# Altium project PIN_CubeSat.PrjPCB (part 1 of 2)
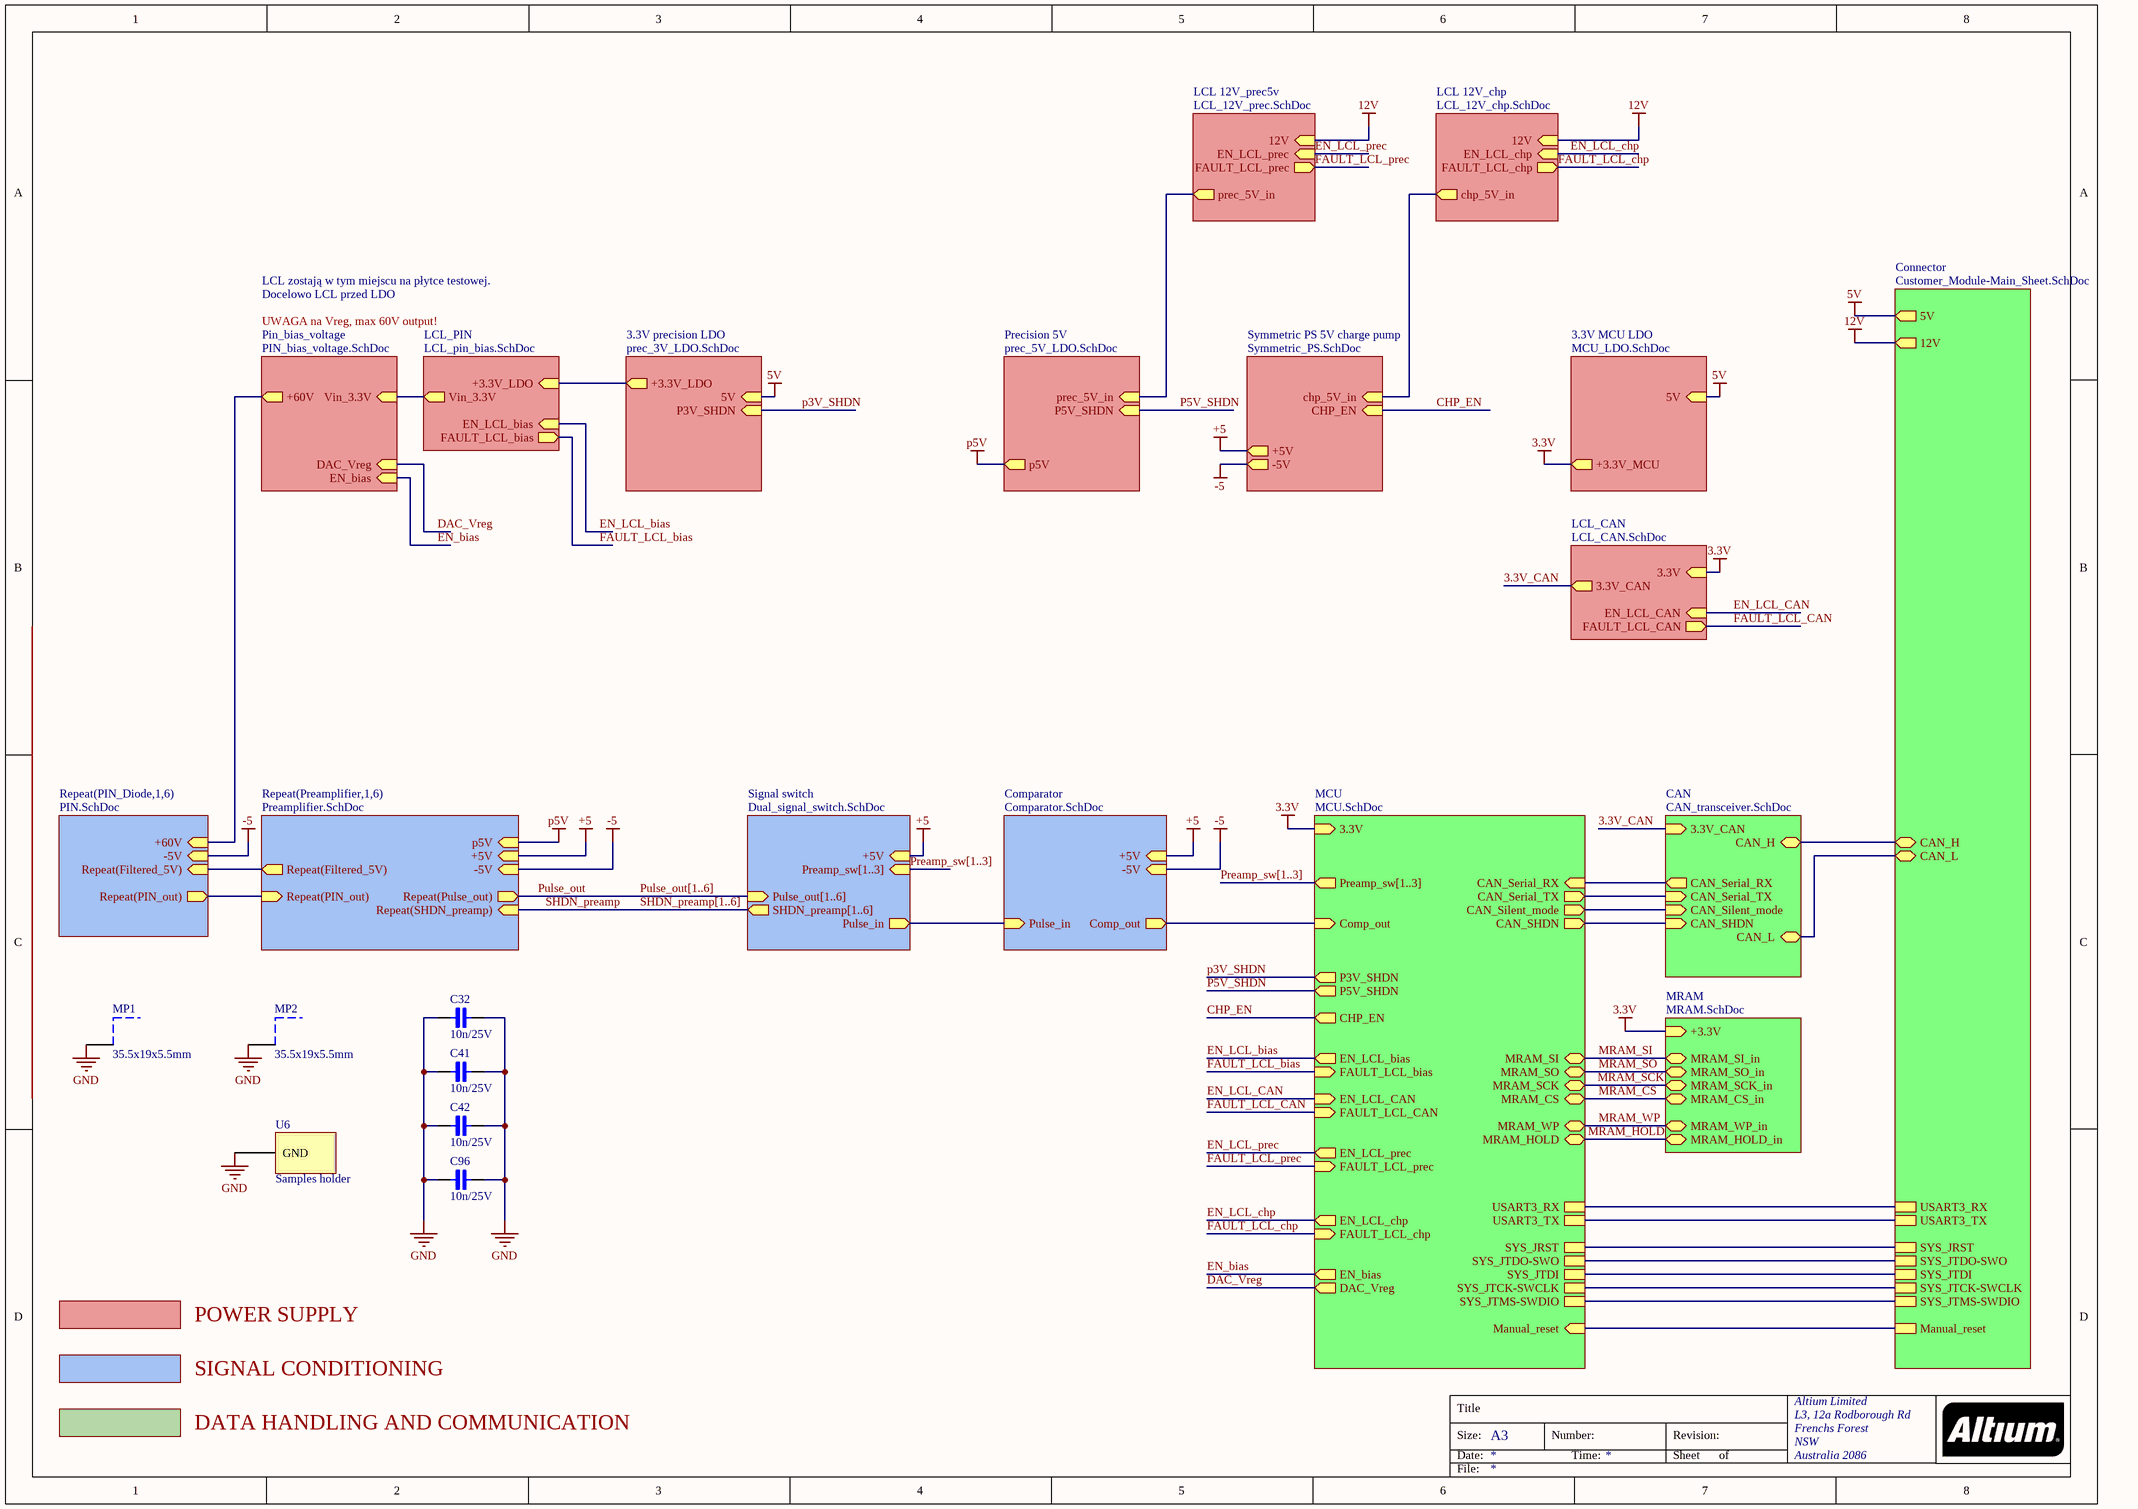
[diagram p0: General_design.SchDoc]
25 sheets, 512 parts. Net scope: hierarchical (ports join the sheet entries above them; power ports are global).
Board file: PIN_detector_test_module.PcbDoc
Sheets:
  General_design.SchDoc
    PIN_Diode1 = PIN.SchDoc
    PIN_Diode2 = PIN.SchDoc
    PIN_Diode3 = PIN.SchDoc
    PIN_Diode4 = PIN.SchDoc
    PIN_Diode5 = PIN.SchDoc
    PIN_Diode6 = PIN.SchDoc
    Preamplifier1 = Preamplifier.SchDoc
    Preamplifier2 = Preamplifier.SchDoc
    Preamplifier3 = Preamplifier.SchDoc
    Preamplifier4 = Preamplifier.SchDoc
    Preamplifier5 = Preamplifier.SchDoc
    Preamplifier6 = Preamplifier.SchDoc
    Pin_bias_voltage = PIN_bias_voltage.SchDoc
    MCU = MCU.SchDoc
    Connector = Customer_Module-Main_Sheet.SchDoc
      Main_Connector = Customer_Module-Main_Connector.SchDoc
      APS_Connector = Customer_Module-APS_Connector.SchDoc
    Comparator = Comparator.SchDoc
    Symmetric PS 5V charge pump = Symmetric_PS.SchDoc
    3.3V precision LDO = prec_3V_LDO.SchDoc
    CAN = CAN_transceiver.SchDoc
    MRAM = MRAM.SchDoc
    LCL_PIN = LCL_pin_bias.SchDoc
    Precision 5V = prec_5V_LDO.SchDoc
    LCL 12V_prec5v = LCL_12V_prec.SchDoc
    LCL 12V_chp = LCL_12V_chp.SchDoc
    Signal switch = Dual_signal_switch.SchDoc
    3.3V MCU LDO = MCU_LDO.SchDoc
    LCL_CAN = LCL_CAN.SchDoc
  LCL_SYM_5V.SchDoc
  Signal_switch.SchDoc
  Preamplifier_switch.SchDoc
  Temp_sensors.SchDoc
  MCU_48pin.SchDoc

## Sheet General_design.SchDoc
size A3; Organization: Altium Limited; Address1: L3, 12a Rodborough Rd; Address2: Frenchs Forest; Address3: NSW; Address4: Australia 2086

### Parts
C32  10n/25V  [Cap_0402]
C41  10n/25V  [Cap_0402]
C42  10n/25V  [Cap_0402]
C96  10n/25V  [Cap_0402]
MP1  35.5x19x5.5mm  [Shiled_35x19]
MP2  35.5x19x5.5mm  [Shiled_35x19]
U6  Samples holder  [RAD_Samples_Holder]

### Sub-sheets
3.3V MCU LDO = MCU_LDO.SchDoc: 5V (in), +3.3V_MCU (out)
3.3V precision LDO = prec_3V_LDO.SchDoc: +3.3V_LDO (out), 5V (in), P3V_SHDN (in)
CAN = CAN_transceiver.SchDoc: 3.3V_CAN (in), CAN_Serial_RX (out), CAN_Serial_TX (in), CAN_H (bidir), CAN_L (bidir), CAN_Silent_mode (in), CAN_SHDN (in)
Comparator = Comparator.SchDoc: Pulse_in (in), Comp_out (out), +5V (in), -5V (in)
Connector = Customer_Module-Main_Sheet.SchDoc: 12V (out), 5V (out), CAN_H (bidir), CAN_L (bidir), SYS_JRST, SYS_JTDO-SWO, SYS_JTDI, SYS_JTCK-SWCLK, SYS_JTMS-SWDIO, USART3_RX, USART3_TX, Manual_reset
LCL 12V_chp = LCL_12V_chp.SchDoc: 12V (in), chp_5V_in (out), EN_LCL_chp (in), FAULT_LCL_chp (out)
LCL 12V_prec5v = LCL_12V_prec.SchDoc: 12V (in), prec_5V_in (out), EN_LCL_prec (in), FAULT_LCL_prec (out)
LCL_CAN = LCL_CAN.SchDoc: EN_LCL_CAN (in), FAULT_LCL_CAN (out), 3.3V (in), 3.3V_CAN (out)
LCL_PIN = LCL_pin_bias.SchDoc: EN_LCL_bias (in), FAULT_LCL_bias (out), +3.3V_LDO (in), Vin_3.3V (out)
MCU = MCU.SchDoc: 3.3V (in), Preamp_sw[1..3] (out), Comp_out (in), P3V_SHDN (out), P5V_SHDN (out), CHP_EN (out), EN_LCL_bias (out), FAULT_LCL_bias (in), EN_LCL_prec (out), FAULT_LCL_prec (in), EN_LCL_chp (out), FAULT_LCL_chp (in), EN_bias (out), CAN_Serial_RX (in), CAN_Serial_TX (out), CAN_Silent_mode (out), MRAM_SO (bidir), MRAM_SCK (bidir), MRAM_WP (bidir), MRAM_HOLD (bidir), MRAM_CS (bidir), MRAM_SI (bidir), DAC_Vreg (out), CAN_SHDN (out), SYS_JRST, SYS_JTDO-SWO, SYS_JTDI, SYS_JTCK-SWCLK, SYS_JTMS-SWDIO, USART3_RX, USART3_TX, Manual_reset (in), EN_LCL_CAN (in), FAULT_LCL_CAN (in)
MRAM = MRAM.SchDoc: MRAM_SO_in (bidir), MRAM_SCK_in (bidir), +3.3V (in), MRAM_WP_in (bidir), MRAM_HOLD_in (bidir), MRAM_CS_in (bidir), MRAM_SI_in (bidir)
Pin_bias_voltage = PIN_bias_voltage.SchDoc: +60V (out), Vin_3.3V (in), EN_bias (in), DAC_Vreg (in)
Precision 5V = prec_5V_LDO.SchDoc: prec_5V_in (in), p5V (out), P5V_SHDN (in)
Repeat(PIN_Diode,1,6) = PIN.SchDoc: -5V (in), +60V (in), Repeat(Filtered_5V) (in), Repeat(PIN_out) (out)
Repeat(Preamplifier,1,6) = Preamplifier.SchDoc: Repeat(Filtered_5V) (out), Repeat(PIN_out) (in), Repeat(Pulse_out) (out), +5V (in), -5V (in), p5V (in), Repeat(SHDN_preamp) (in)
Signal switch = Dual_signal_switch.SchDoc: Pulse_out[1..6] (in), Pulse_in (out), +5V (in), Preamp_sw[1..3] (in), SHDN_preamp[1..6] (out)
Symmetric PS 5V charge pump = Symmetric_PS.SchDoc: +5V (out), -5V (out), chp_5V_in (in), CHP_EN (in)

### Nets
3.3V: sheet MCU/3.3V, sheet MRAM/+3.3V, sheet 3.3V MCU LDO/+3.3V_MCU, sheet LCL_CAN/3.3V
5V: sheet Connector/5V, sheet 3.3V precision LDO/5V, sheet 3.3V MCU LDO/5V
12V: sheet Connector/12V, sheet LCL 12V_prec5v/12V, sheet LCL 12V_chp/12V
+5: sheet Repeat(Preamplifier,1,6)/+5V, sheet Comparator/+5V, sheet Symmetric PS 5V charge pump/+5V, sheet Signal switch/+5V
-5: sheet Repeat(PIN_Diode,1,6)/-5V, sheet Repeat(Preamplifier,1,6)/-5V, sheet Comparator/-5V, sheet Symmetric PS 5V charge pump/-5V
GND: C32.1 C32.2 C41.1 C41.2 C42.1 C42.2 C96.1 C96.2 MP1.1 MP2.1 U6.5(GND)
p5V: sheet Repeat(Preamplifier,1,6)/p5V, sheet Precision 5V/p5V
3.3V_CAN: sheet CAN/3.3V_CAN, sheet LCL_CAN/3.3V_CAN
+3.3V_LDO: sheet 3.3V precision LDO/+3.3V_LDO, sheet LCL_PIN/+3.3V_LDO
+60V: sheet Repeat(PIN_Diode,1,6)/+60V, sheet Pin_bias_voltage/+60V
CAN_H: sheet Connector/CAN_H, sheet CAN/CAN_H
CAN_L: sheet Connector/CAN_L, sheet CAN/CAN_L
CAN_Serial_RX: sheet MCU/CAN_Serial_RX, sheet CAN/CAN_Serial_RX
CAN_Serial_TX: sheet MCU/CAN_Serial_TX, sheet CAN/CAN_Serial_TX
CAN_SHDN: sheet MCU/CAN_SHDN, sheet CAN/CAN_SHDN
CAN_Silent_mode: sheet MCU/CAN_Silent_mode, sheet CAN/CAN_Silent_mode
CHP_5V_in: sheet Symmetric PS 5V charge pump/chp_5V_in, sheet LCL 12V_chp/chp_5V_in
CHP_EN: sheet MCU/CHP_EN, sheet Symmetric PS 5V charge pump/CHP_EN
Comp_out: sheet MCU/Comp_out, sheet Comparator/Comp_out
DAC_Vreg: sheet Pin_bias_voltage/DAC_Vreg, sheet MCU/DAC_Vreg
EN_bias: sheet Pin_bias_voltage/EN_bias, sheet MCU/EN_bias
EN_LCL_bias: sheet MCU/EN_LCL_bias, sheet LCL_PIN/EN_LCL_bias
EN_LCL_CAN: sheet MCU/EN_LCL_CAN, sheet LCL_CAN/EN_LCL_CAN
EN_LCL_chp: sheet MCU/EN_LCL_chp, sheet LCL 12V_chp/EN_LCL_chp
EN_LCL_prec: sheet MCU/EN_LCL_prec, sheet LCL 12V_prec5v/EN_LCL_prec
FAULT_LCL_bias: sheet MCU/FAULT_LCL_bias, sheet LCL_PIN/FAULT_LCL_bias
FAULT_LCL_CAN: sheet MCU/FAULT_LCL_CAN, sheet LCL_CAN/FAULT_LCL_CAN
FAULT_LCL_chp: sheet MCU/FAULT_LCL_chp, sheet LCL 12V_chp/FAULT_LCL_chp
FAULT_LCL_prec: sheet MCU/FAULT_LCL_prec, sheet LCL 12V_prec5v/FAULT_LCL_prec
Manual_reset: sheet MCU/Manual_reset, sheet Connector/Manual_reset
MRAM_CS: sheet MCU/MRAM_CS, sheet MRAM/MRAM_CS_in
MRAM_HOLD: sheet MCU/MRAM_HOLD, sheet MRAM/MRAM_HOLD_in
MRAM_SCK: sheet MCU/MRAM_SCK, sheet MRAM/MRAM_SCK_in
MRAM_SI: sheet MCU/MRAM_SI, sheet MRAM/MRAM_SI_in
MRAM_SO: sheet MCU/MRAM_SO, sheet MRAM/MRAM_SO_in
MRAM_WP: sheet MCU/MRAM_WP, sheet MRAM/MRAM_WP_in
p3V_SHDN: sheet MCU/P3V_SHDN, sheet 3.3V precision LDO/P3V_SHDN
P5V_SHDN: sheet MCU/P5V_SHDN, sheet Precision 5V/P5V_SHDN
prec_5V_in: sheet Precision 5V/prec_5V_in, sheet LCL 12V_prec5v/prec_5V_in
Pulse_in: sheet Comparator/Pulse_in, sheet Signal switch/Pulse_in
Pulse_out: sheet Repeat(Preamplifier,1,6)/Repeat(Pulse_out)  [also labelled Pulse_out[1..6]]
SHDN_preamp: sheet Repeat(Preamplifier,1,6)/Repeat(SHDN_preamp)  [also labelled SHDN_preamp[1..6]]
SYS_JRST: sheet MCU/SYS_JRST, sheet Connector/SYS_JRST
SYS_JTCK-SWCLK: sheet MCU/SYS_JTCK-SWCLK, sheet Connector/SYS_JTCK-SWCLK
SYS_JTDI: sheet MCU/SYS_JTDI, sheet Connector/SYS_JTDI
SYS_JTDO-SWO: sheet MCU/SYS_JTDO-SWO, sheet Connector/SYS_JTDO-SWO
SYS_JTMS-SWDIO: sheet MCU/SYS_JTMS-SWDIO, sheet Connector/SYS_JTMS-SWDIO
USART3_RX: sheet MCU/USART3_RX, sheet Connector/USART3_RX
USART3_TX: sheet MCU/USART3_TX, sheet Connector/USART3_TX
Vin_3.3V: sheet Pin_bias_voltage/Vin_3.3V, sheet LCL_PIN/Vin_3.3V
(unnamed): sheet Repeat(PIN_Diode,1,6)/Repeat(Filtered_5V), sheet Repeat(Preamplifier,1,6)/Repeat(Filtered_5V)
(unnamed): sheet Repeat(PIN_Diode,1,6)/Repeat(PIN_out), sheet Repeat(Preamplifier,1,6)/Repeat(PIN_out)

### Buses and harness runs
bus Preamp_sw[1..3] = sheet MCU/Preamp_sw[1..3]
bus Preamp_sw[1..3] = sheet Signal switch/Preamp_sw[1..3]

### Notes on the sheet
- LCL zostają w tym miejscu na płytce testowej.
- Docelowo LCL przed LDO
- UWAGA na Vreg, max 60V output!
- POWER SUPPLY
- SIGNAL CONDITIONING
- DATA HANDLING AND COMMUNICATION
- Title
- Size:
- Date:
- A3
- Number:
- Time:
- Revision:
- Sheet
- of
- File:

### Library data of the parts
C32 C41 C42 C96 = Cap_0402_10n: Ceramic Capacitor 10n / 0402 / 25V / ±5%, Wurth Elektronik MLCC; ComponentLink1Description: New link; ComponentLink1URL: https://www.we-online.com/catalog/en/WCAP-CSGP-25VDC
MP1 MP2 = Shield 35x19: WE-SHC Shielding Cabinet, SMT Frame Seamless, Tin Plated, Tray, 35.5x19x5.5mm; Manufacturer Part Number: 3670355; Manufacturer: Wurth Elektronik; Base Material: Steel; Type: SMT Frame Seamless; Width: 19mm; Published Date: November 2020; Plating: Tin Plated; Packaging: Tray; Operating Temperature: -40 to +125degC; Mounting Technology: SMT; Length: 35.5mm; Height: 5.5mm; ComponentLink2URL: https://www.we-online.com/catalog/datasheet/3670355.pdf; ComponentLink2Description: Datasheet; ComponentLink1URL: http://www.we-online.de; ComponentLink1Description: Manufacturer
U6 = RAD_samples_holder: Mechanical aprt

## Sheet PIN.SchDoc
size A4; Organization: Altium Limited; Address1: L3, 12a Rodborough Rd; Address2: Frenchs Forest; Address3: NSW; Address4: Australia 2086
Used 6 times, as channels PIN_Diode1, PIN_Diode2, PIN_Diode3, PIN_Diode4, PIN_Diode5, PIN_Diode6. Parts and nets are listed once, with the designators drawn on the sheet.
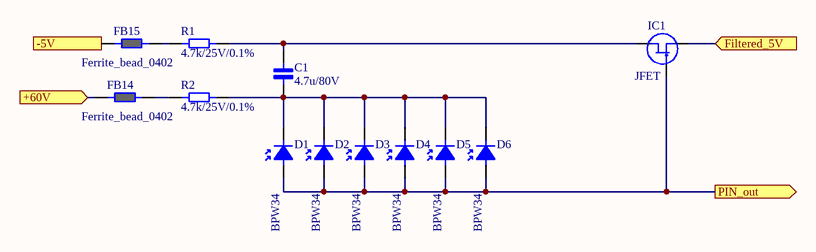
[diagram p1: PIN.SchDoc]

### Parts
C1  4.7u/80V  [CAP_1210]
D1  BPW34  [BPW34]
D2  BPW34  [BPW34]
D3  BPW34  [BPW34]
D4  BPW34  [BPW34]
D5  BPW34  [BPW34]
D6  BPW34  [BPW34]
FB14  Ferrite_bead_0402  [FERRITE_0402]
FB15  Ferrite_bead_0402  [FERRITE_0402]
IC1  JFET  [SOT23-3]
R1  4.7k/25V/0.1%  [RES_0603]
R2  4.7k/25V/0.1%  [RES_0603]

### Ports
+60V (in), -5V (in), Filtered_5V (in), PIN_out (out)

### Nets
+60V: FB14.1 ; port +60V
-5V: FB15.1 ; port -5V
Filtered_5V: IC1.2(D) ; port Filtered_5V
PIN_out: D1.1 D2.1 D3.1 D4.1 D5.1 D6.1 IC1.3(G) ; port PIN_out
NetC1_1: C1.1 D1.2 D2.2 D3.2 D4.2 D5.2 D6.2 R2.2
NetC1_2: C1.2 IC1.1(S) R1.2
NetFB14_2: FB14.2 R2.1
NetFB15_2: FB15.2 R1.1

### Channels
PIN_Diode1: designators end in _PIN_Diode1; ports +60V=+60V -5V=-5 Filtered_5V=Filtered_5V_PIN_Diode1 PIN_out=PIN_out_PIN_Diode1
PIN_Diode2: designators end in _PIN_Diode2; ports +60V=+60V -5V=-5 Filtered_5V=Filtered_5V_PIN_Diode2 PIN_out=PIN_out_PIN_Diode2
PIN_Diode3: designators end in _PIN_Diode3; ports +60V=+60V -5V=-5 Filtered_5V=Filtered_5V_PIN_Diode3 PIN_out=PIN_out_PIN_Diode3
PIN_Diode4: designators end in _PIN_Diode4; ports +60V=+60V -5V=-5 Filtered_5V=Filtered_5V_PIN_Diode4 PIN_out=PIN_out_PIN_Diode4
PIN_Diode5: designators end in _PIN_Diode5; ports +60V=+60V -5V=-5 Filtered_5V=Filtered_5V_PIN_Diode5 PIN_out=PIN_out_PIN_Diode5
PIN_Diode6: designators end in _PIN_Diode6; ports +60V=+60V -5V=-5 Filtered_5V=Filtered_5V_PIN_Diode6 PIN_out=PIN_out_PIN_Diode6

### Notes on the sheet
- Title
- Size:
- Date:
- A4
- Number:
- Time:
- Revision:
- Sheet
- of
- File:

### Library data of the parts
C1 = Cap_1210_4.7u: Multilayer Ceramic Capacitors MLCC - SMD/SMT 1210 4.7uF 80volts *Derate Voltage/Temp; Manufacturer: Murata; Manufacturer Part Number: GRM32ER71K475KE14L; Voltage Rating (DC): 80V; Dielectric: X7R; Tolerance: 10%; Supplier 1: Digi-Key; RoHS: Yes; Category: Ceramic Capacitors; Stock 1: 275397; Pricing 1: 1=1.05000, 10=0.79900, 50=0.66340, 100=0.57130, 500=0.44234 (USD); Mount: Surface Mount; Case/Package: 1210; Weight: 0.00388oz; Dielectric Material: Ceramic; Case Code (Metric): 3225; Case Code (Imperial): 1210; Min Operating Temperature: -55°C; Max Operating Temperature: 125°C; Package Quantity: 1000; Packaging: Tape and Reel; Voltage Rating: 80V; Voltage: 80V; Termination: SMD/SMT; Capacitance: 4.7uF; Length: 3.2mm; Width: 2.5mm; Height: 2.5mm; Thickness: 0.106inch; Depth: 2.5mm; Lead Free: Lead Free; ComponentLink1URL: http://www.mouser.com/ds/2/281/c02e-2905.pdf?src-supplier=Mouser; ComponentLink1Description: http://www.mouser.com/ds/2/281/c02e-2905.pdf?src-supplier=Mouser; ComponentLink2URL: http://search.murata.co.jp/Ceramy/image/img/A01X/G101/ENG/GRM32ER71K475KE14-01.pdf?src-supplier=Digi-Key; ComponentLink2Description: http://search.murata.co.jp/Ceramy/image/img/A01X/G101/ENG/GRM32ER71K475KE14-01.pdf?src-supplier=Digi-Key
D1-D6 = BPW34 PIN Photodiode: VBPW34S, Pin photodiode, 60V reverse bias max; ComponentLink1Description: New link; ComponentLink1URL: https://pl.mouser.com/datasheet/2/427/vbpw34s-1766836.pdf
FB14 FB15 = Ferrite_bead_0402: Ferrite bead, wurth 74269241102
IC1 = BF861C: Trans JFET N-CH 25V 3-Pin TO-236AB; Manufacturer: NXP Semiconductors; Supplier 1: Arrow Electronics; Manufacturer Part Number: BF861C; RoHS: Yes; Category: Uncategorized; Number of Pins: 3; ComponentLink1URL: http://docs-usa.electrocomponents.com/techlib:/itc_doclist_US.htm?stockno=6262412&src-supplier=Allied+Electronics; ComponentLink1Description: http://docs-usa.electrocomponents.com/techlib:/itc_doclist_US.htm?stockno=6262412&src-supplier=Allied+Electronics; Supplier Part Number 1: BF861C
R1 R2 = Res_0603_4.7k: Vishay, thin film resistor 4.7k/25V/0.1%

## Sheet Preamplifier.SchDoc
size A3; Organization: Altium Limited; Address1: L3, 12a Rodborough Rd; Address2: Frenchs Forest; Address3: NSW; Address4: Australia 2086
Used 6 times, as channels Preamplifier1, Preamplifier2, Preamplifier3, Preamplifier4, Preamplifier5, Preamplifier6. Parts and nets are listed once, with the designators drawn on the sheet.
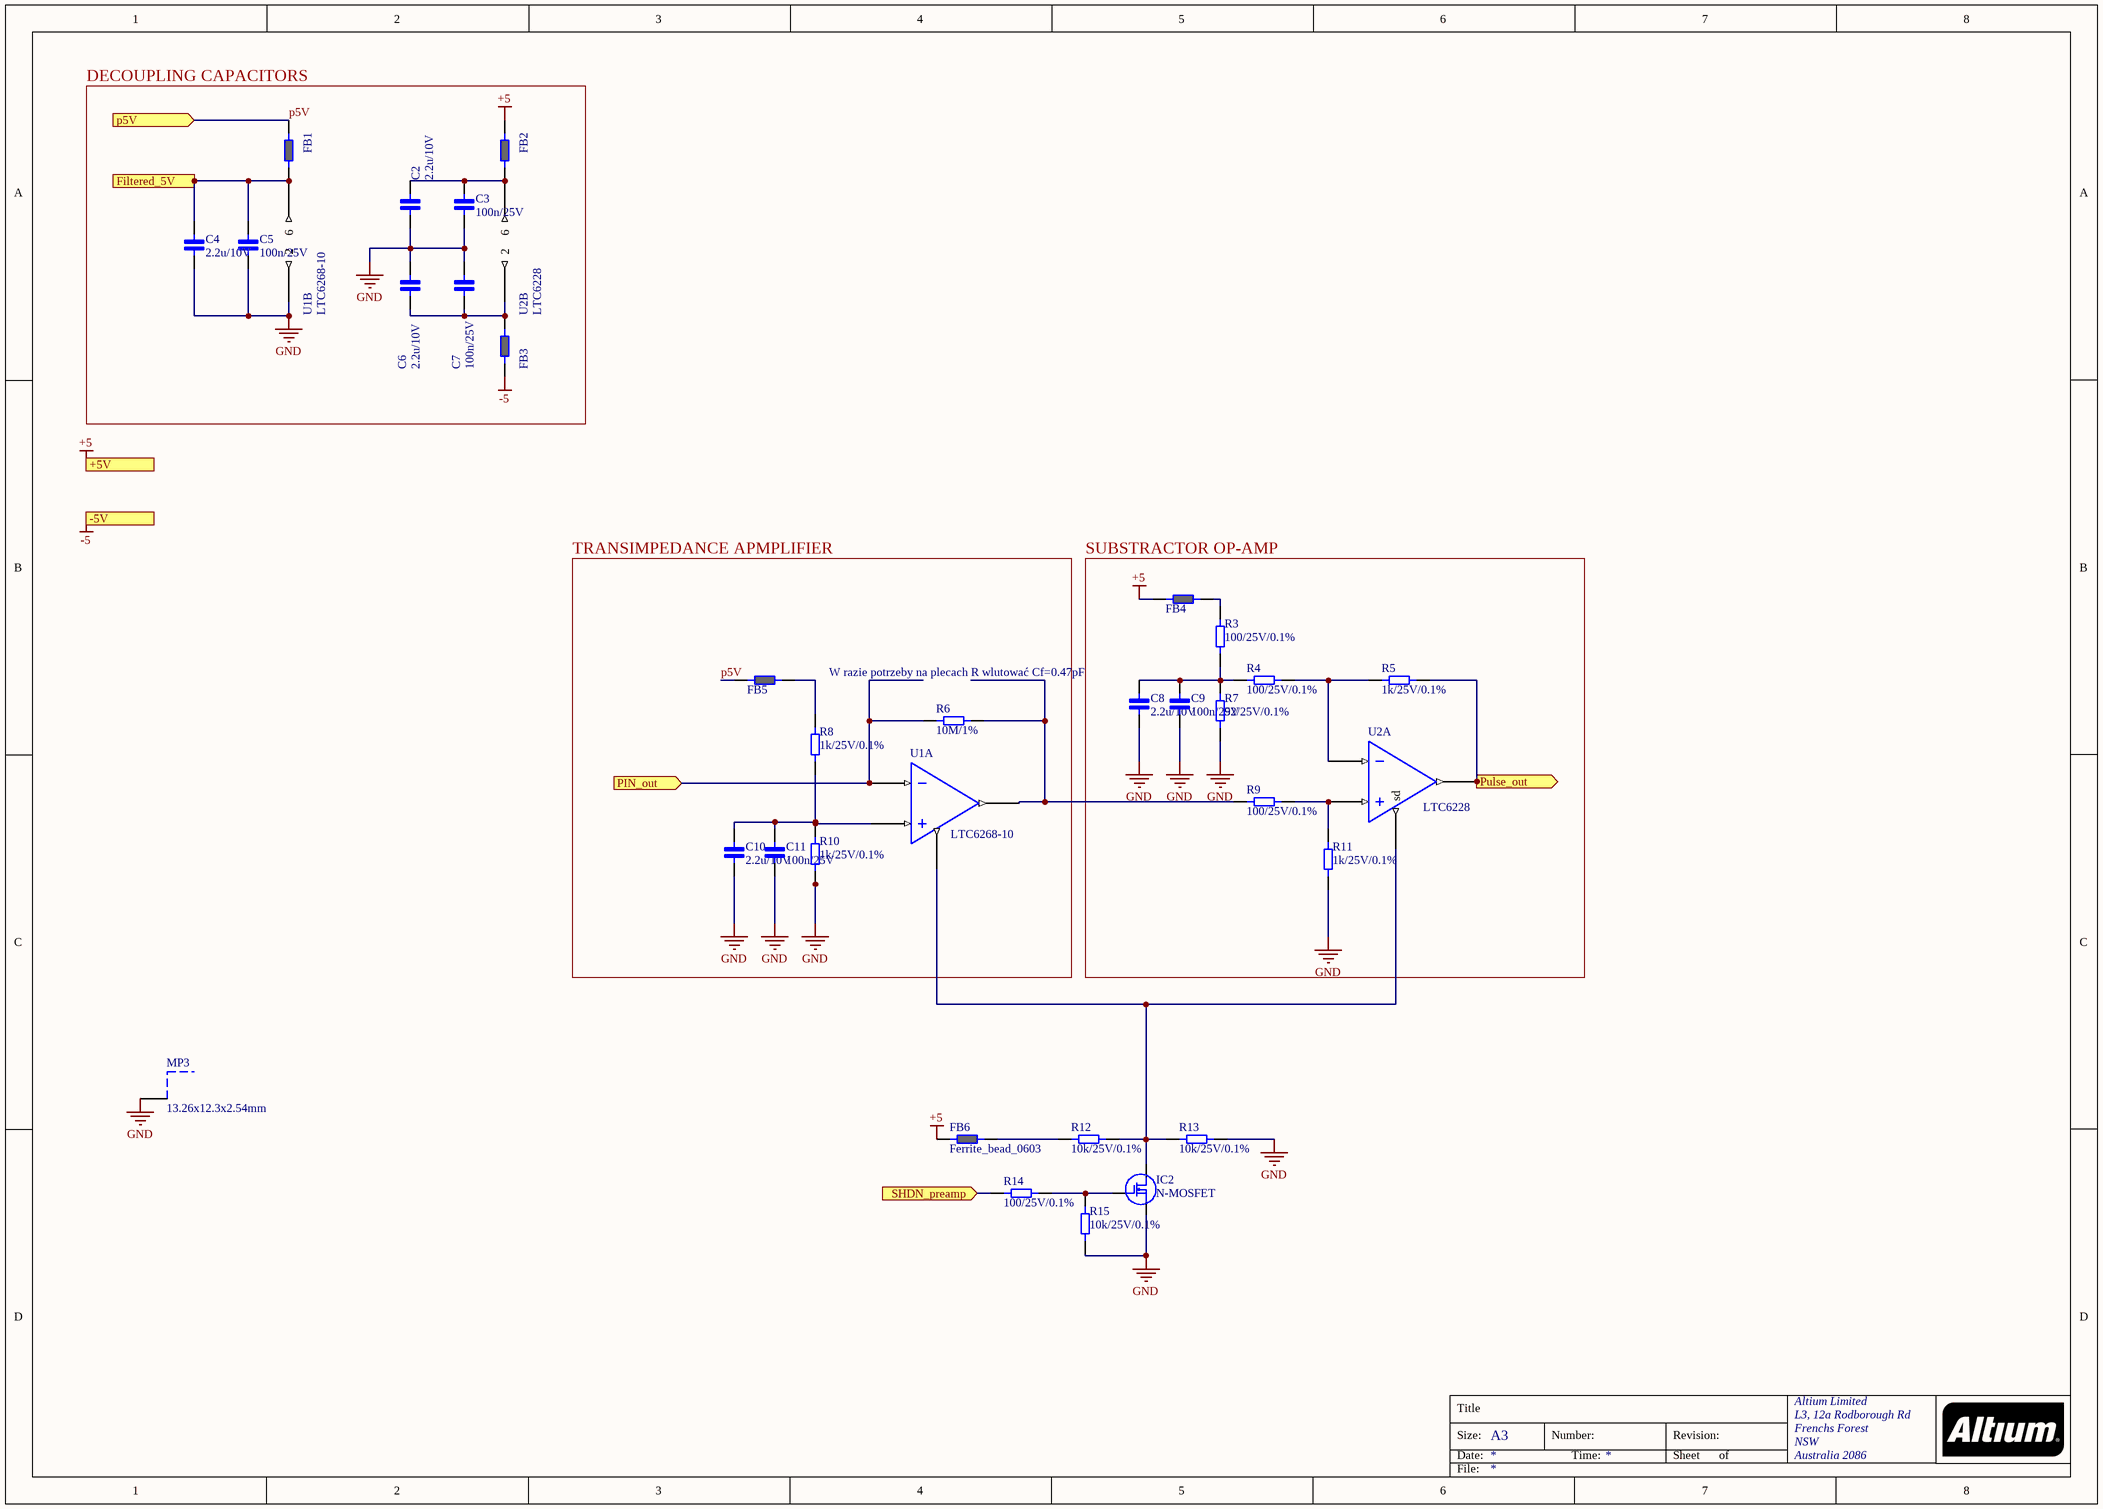
[diagram p2: Preamplifier.SchDoc]

### Parts
C2  2.2u/10V  [Cap_0402]
C3  100n/25V  [Cap_0402]
C4  2.2u/10V  [Cap_0402]
C5  100n/25V  [Cap_0402]
C6  2.2u/10V  [Cap_0402]
C7  100n/25V  [Cap_0402]
C8  2.2u/10V  [Cap_0402]
C9  100n/25V  [Cap_0402]
C10  2.2u/10V  [Cap_0402]
C11  100n/25V  [Cap_0402]
FB1  Ferrite_bead_0603  [Ferrite_0603]  (value not drawn)
FB2  Ferrite_bead_0603  [Ferrite_0603]  (value not drawn)
FB3  Ferrite_bead_0603  [Ferrite_0603]  (value not drawn)
FB4  Ferrite_bead_0603  [Ferrite_0603]  (value not drawn)
FB5  Ferrite_bead_0603  [Ferrite_0603]  (value not drawn)
FB6  Ferrite_bead_0603  [Ferrite_0603]
IC2  N-MOSFET  [SOT23-3]
MP3  13.26x12.3x2.54mm  [3610213126S]
R3  100/25V/0.1%  [RES_0402]
R4  100/25V/0.1%  [RES_0402]
R5  1k/25V/0.1%  [RES_0402]
R6  10M/1%  [RES_1206_prec]
R7  92/25V/0.1%  [RES_0402]
R8  1k/25V/0.1%  [RES_0402]
R9  100/25V/0.1%  [RES_0402]
R10  1k/25V/0.1%  [RES_0402]
R11  1k/25V/0.1%  [RES_0402]
R12  10k/25V/0.1%  [RES_0402]
R13  10k/25V/0.1%  [RES_0402]
R14  100/25V/0.1%  [RES_0402]
R15  10k/25V/0.1%  [RES_0402]
U1  LTC6268-10  [SOT-23-6]  (parts A,B of 2)
U2  LTC6228  [SOT-23-6]  (parts A,B of 2)

### Blocks framed on the sheet
DECOUPLING CAPACITORS: C2-C7 FB1-FB3 U1 U2
TRANSIMPEDANCE APMPLIFIER: C10 C11 FB5 R6 R8 R10 U1
SUBSTRACTOR OP-AMP: C8 C9 FB4 R3-R5 R7 R9 R11 U2

### Ports
+5V (in), -5V (in), Filtered_5V (out), p5V (in), PIN_out (in), Pulse_out (out), SHDN_preamp (in)

### Nets
+5: FB2.2 FB4.2 FB6.1 ; port +5V
-5: FB3.1 ; port -5V
GND: C2.1 C3.1 C4.1 C5.1 C6.2 C7.2 C8.1 C9.1 C10.1 C11.1 IC2.2(S) MP3.1 R7.1 R10.1 R11.1 R13.2 R15.1 U1.2
Filtered_5V: C4.2 C5.2 FB1.1 U1.6 ; port Filtered_5V
p5V: FB1.2 FB5.2 ; port p5V
PIN_out: R6.1 U1.4 ; port PIN_out
Pulse_out: R5.2 U2.1 ; port Pulse_out
SHDN_preamp: R14.1 ; port SHDN_preamp
NetC2_2: C2.2 C3.2 FB2.1 U2.6
NetC6_1: C6.1 C7.1 FB3.2 U2.2
NetC8_2: C8.2 C9.2 R3.1 R4.1 R7.2
NetC10_2: C10.2 C11.2 R8.1 R10.2 U1.3
NetFB4_1: FB4.1 R3.2
NetFB5_1: FB5.1 R8.2
NetFB6_2: FB6.2 R12.1
NetIC2_1: IC2.1(G) R14.2 R15.2
NetIC2_3: IC2.3(D) R12.2 R13.1 U1.5(sd) U2.5(sd)
NetR4_2: R4.2 R5.1 U2.4
NetR6_2: R6.2 R9.1 U1.1
NetR9_2: R9.2 R11.2 U2.3

### Channels
Preamplifier1: designators end in _Preamplifier1; ports +5V=+5 -5V=-5 Filtered_5V=Filtered_5V_Preamplifier1 p5V=p5V PIN_out=PIN_out_Preamplifier1 Pulse_out=Pulse_out1 SHDN_preamp=SHDN_preamp1
Preamplifier2: designators end in _Preamplifier2; ports +5V=+5 -5V=-5 Filtered_5V=Filtered_5V_Preamplifier2 p5V=p5V PIN_out=PIN_out_Preamplifier2 Pulse_out=Pulse_out2 SHDN_preamp=SHDN_preamp2
Preamplifier3: designators end in _Preamplifier3; ports +5V=+5 -5V=-5 Filtered_5V=Filtered_5V_Preamplifier3 p5V=p5V PIN_out=PIN_out_Preamplifier3 Pulse_out=Pulse_out3 SHDN_preamp=SHDN_preamp3
Preamplifier4: designators end in _Preamplifier4; ports +5V=+5 -5V=-5 Filtered_5V=Filtered_5V_Preamplifier4 p5V=p5V PIN_out=PIN_out_Preamplifier4 Pulse_out=Pulse_out4 SHDN_preamp=SHDN_preamp4
Preamplifier5: designators end in _Preamplifier5; ports +5V=+5 -5V=-5 Filtered_5V=Filtered_5V_Preamplifier5 p5V=p5V PIN_out=PIN_out_Preamplifier5 Pulse_out=Pulse_out5 SHDN_preamp=SHDN_preamp5
Preamplifier6: designators end in _Preamplifier6; ports +5V=+5 -5V=-5 Filtered_5V=Filtered_5V_Preamplifier6 p5V=p5V PIN_out=PIN_out_Preamplifier6 Pulse_out=Pulse_out6 SHDN_preamp=SHDN_preamp6

### Notes on the sheet
- (near C8) W razie potrzeby na plecach R wlutować Cf=0.47pF
- Title
- Size:
- Date:
- A3
- Number:
- Time:
- Revision:
- Sheet
- of
- File:

### Library data of the parts
C2 C4 C6 C8 C10 = Cap_0402_2.2u: Ceramic Capacitor 2.2uF / 0402 / 10V / ±5%, Wurth Elektronik MLCC
C3 C5 C7 C9 C11 = Cap_0402_100n: Ceramic Capacitor 100n / 0402 / 25V / ±5%, Wurth Elektronik MLCC; ComponentLink1Description: New link; ComponentLink1URL: https://www.we-online.com/catalog/en/WCAP-CSGP-25VDC
FB1-FB6 = Ferrite_bead_0603: Ferrite bead
IC2 = BSS138K: n-mosfet 50V, low threshold; Manufacturer: NXP Semiconductors; Manufacturer Part Number: BF861C; Supplier 1: Arrow Electronics; RoHS: Yes; Category: Uncategorized; Number of Pins: 3; ComponentLink1URL: http://docs-usa.electrocomponents.com/techlib:/itc_doclist_US.htm?stockno=6262412&src-supplier=Allied+Electronics; ComponentLink1Description: http://docs-usa.electrocomponents.com/techlib:/itc_doclist_US.htm?stockno=6262412&src-supplier=Allied+Electronics; Supplier Part Number 1: BF861C
MP3 = 3610213126S: WE-SHC Shielding Cabinet, SMT Frame, Tin Plated, Tape and Reel, 13.26x12.3x2.54mm; Manufacturer: Wurth Elektronik; Base Material: Steel; ComponentLink1Description: Manufacturer; ComponentLink1URL: http://www.we-online.de; ComponentLink2Description: Datasheet; ComponentLink2URL: https://www.we-online.com/catalog/datasheet/3610213126S.pdf; Operating Temperature: -40 to +125degC; Packaging: Tape and Reel; Plating: Tin; Length: 13.26mm; Type: SMD Frame; Height: 2.54mm; Manufacturer Part Number: 3610213126S; Mounting Technology: SMT; Published Date: April 2020; Width: 12.3mm
R3 R4 R9 R14 = Res_0402_100: Vishay, thin film resistor 100/25V/0.1%
R5 R8 R10 R11 = Res_0402_1k: Vishay, thin film resistor 1k/25V/0.1%
R6 = Prec_res_10M: Res Thin Film 1206 10M Ohm 0.1% 0.33W(1/3W) ±50ppm/C Sulfur Resistant Pad SMD T/R; Manufacturer: Vishay Dale; Manufacturer Part Number: P1206H1005BGT; Temperature Coefficient: 50ppm/°C; Resistance: 10MR; Supplier 1: Mouser; RoHS: No; Category: Chip SMD Resistors; Stock 1: 96; Pricing 1: 1=7.55000, 10=6.80000, 50=6.19000, 100=5.59000, 200=5.14000, 500=4.68000, 1000=4.08000, 2500=3.93000, 5000=3.77000 (USD); Case/Package: 1206; Contact Plating: Gold; Min Operating Temperature: -55°C; Max Operating Temperature: 155°C; Resistor Type: Thin Film; Tolerance: 0.1%; Packaging: Tape and Reel; Radiation Hardening: No; ComponentLink1URL: https://datasheet.ciiva.com/9051/p-9051054.pdf?src-supplier=Avnet; ComponentLink1Description: https://datasheet.ciiva.com/9051/p-9051054.pdf?src-supplier=Avnet
R7 = Res_0402_92: Vishay, thin film resistor 92/25V/0.1%
R12 R13 R15 = Res_0402_10k: Vishay, thin film resistor 10k/25V/0.1%
U1 = LTC6268: 4 ghz, ultra-low noise opamp; ComponentLink1Description: New link; ComponentLink1URL: https://pl.mouser.com/datasheet/2/609/626810f-1279531.pdf
U2 = LTC6228: 0.88nV/√Hz 730MHz, 500V/µs, / Low Distortion Rail-to-Rail Output Op / Amps with Shutdown; ComponentLink1Description: New link; ComponentLink1URL: https://pl.mouser.com/datasheet/2/609/LTC6228_6229-1660243.pdf

## Sheet PIN_bias_voltage.SchDoc
size A3; Organization: Altium Limited; Address1: L3, 12a Rodborough Rd; Address2: Frenchs Forest; Address3: NSW; Address4: Australia 2086
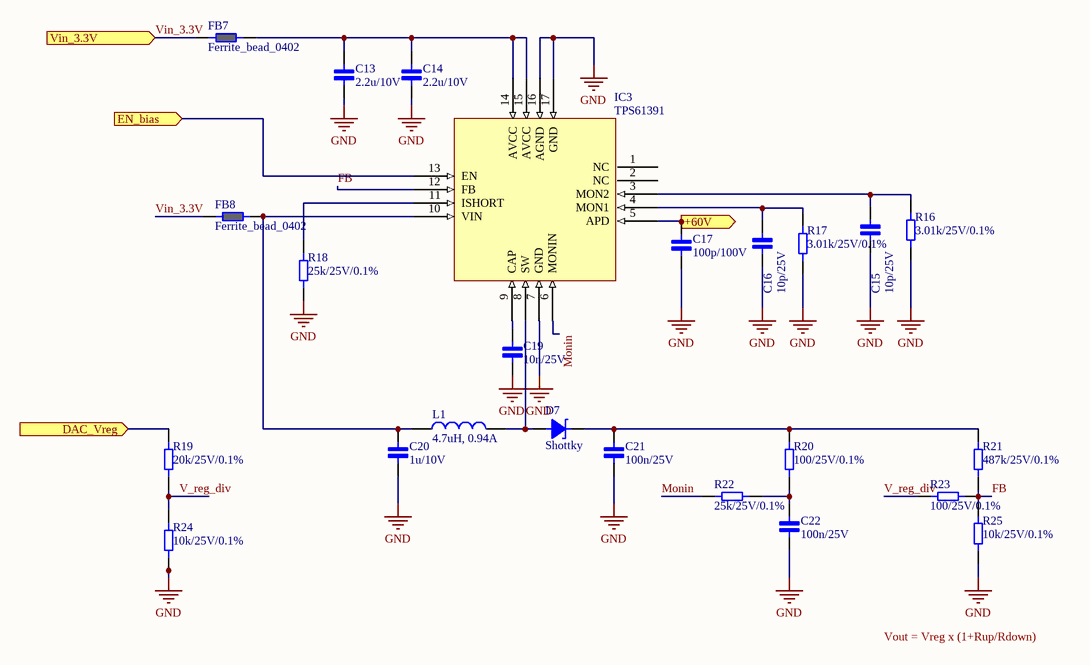
[diagram p3: PIN_bias_voltage.SchDoc]

### Parts
C13  2.2u/10V  [Cap_0402]
C14  2.2u/10V  [Cap_0402]
C15  10p/25V  [Cap_0402]
C16  10p/25V  [Cap_0402]
C17  100p/100V  [Cap_0402]
C19  10n/25V  [Cap_0402]
C20  1u/10V  [Cap_0402]
C21  100n/25V  [Cap_0402]
C22  100n/25V  [Cap_0402]
D7  Shottky  [SOD323]
FB7  Ferrite_bead_0402  [FERRITE_0402]
FB8  Ferrite_bead_0402  [FERRITE_0402]
IC3  TPS61391  [WQFN16]
L1  4.7uH, 0.94A  [WE-MAPI_2510]
R16  3.01k/25V/0.1%  [RES_0402]
R17  3.01k/25V/0.1%  [RES_0402]
R18  25k/25V/0.1%  [RES_0402]
R19  20k/25V/0.1%  [RES_0402]
R20  100/25V/0.1%  [RES_0402]
R21  487k/25V/0.1%  [RES_0402]
R22  25k/25V/0.1%  [RES_0402]
R23  100/25V/0.1%  [RES_0402]
R24  10k/25V/0.1%  [RES_0402]
R25  10k/25V/0.1%  [RES_0402]

### Ports
+60V (out), DAC_Vreg (in), EN_bias (in), Vin_3.3V (in)

### Nets
GND: C13.1 C14.1 C15.1 C16.1 C17.1 C19.1 C20.1 C21.1 C22.1 IC3.7(GND) IC3.16(AGND) IC3.17(GND) R16.1 R17.1 R18.1 R24.1 R25.1
+60V: C17.2 IC3.5(APD) ; port +60V
DAC_Vreg: R19.2 ; port DAC_Vreg
EN_bias: IC3.13(EN) ; port EN_bias
FB: IC3.12(FB) R21.1 R23.2 R25.2
Monin: IC3.6(MONIN) R22.1
V_reg_div: R19.1 R23.1 R24.2
Vin_3.3V: FB7.1 FB8.1 ; port Vin_3.3V
NetC13_2: C13.2 C14.2 FB7.2 IC3.14(AVCC) IC3.15(AVCC)
NetC15_2: C15.2 IC3.3(MON2) R16.2
NetC16_2: C16.2 IC3.4(MON1) R17.2
NetC19_2: C19.2 IC3.9(CAP)
NetC20_2: C20.2 FB8.2 IC3.10(VIN) L1.1
NetC21_2: C21.2 D7.2 R20.2 R21.2
NetC22_2: C22.2 R20.1 R22.2
NetD7_1: D7.1 IC3.8(SW) L1.2
NetIC3_11: IC3.11(ISHORT) R18.2

Not connected (* = marked no-connect by the designer): IC3 1(NC) 2(NC)

### Notes on the sheet
- Vout = Vreg x (1+Rup/Rdown)
- Title
- Size:
- Date:
- A3
- Number:
- Time:
- Revision:
- Sheet
- of
- File:

### Library data of the parts
C13 C14 = Cap_0402_2.2u: as C2 on sheet Preamplifier
C15 C16 = Cap_0402_10p: 0402 / 25V / ±5%, Wurth Elektronik MLCC; ComponentLink1Description: New link; ComponentLink1URL: https://www.we-online.com/catalog/en/WCAP-CSGP-25VDC
C17 = Cap_0402_100p_hv: 0402 / 100V / ±5%, Wurth Elektronik MLCC; ComponentLink1Description: New link; ComponentLink1URL: https://www.we-online.com/catalog/en/WCAP-CSGP-25VDC
C19 = Cap_0402_10n: as C32 on sheet General_design; ComponentLink1Description: New link; ComponentLink1URL: https://www.we-online.com/catalog/en/WCAP-CSGP-25VDC
C20 = Cap_0402_1u: Ceramic Capacitor 1uF / 0402 / 10V / ±5%, Wurth Elektronik MLCC
C21 C22 = Cap_0402_100n: as C3 on sheet Preamplifier; ComponentLink1Description: New link; ComponentLink1URL: https://www.we-online.com/catalog/en/WCAP-CSGP-25VDC
D7 = 1SS355VMFHTE-17: Schottky diode, 90V, 100mA, 1.2V, 4ns; ComponentLink1Description: New link; ComponentLink1URL: http://www.farnell.com/datasheets/2296360.pdf?_ga=2.82751826.559014072.1603739164-289843645.1554760282&_gac=1.61669086.1603127928.Cj0KCQjw8rT8BRCbARIsALWiOvSVwk9r5eslWLPnwyA40yS03dA_HOx56l5PpmQm_xU-UzALJc7kcHAaAvh7EALw_wcB
FB7 FB8 = Ferrite_bead_0402: Ferrite bead, wurth 74269241102
IC3 = TPS61391: TPS61391 85-VOUT Boost Converter with Current Mirror Integrated; ComponentLink1Description: New link; ComponentLink1URL: https://www.ti.com/lit/ds/symlink/tps61391.pdf
L1 = 74438323047: WE-MAPI SMT Power Inductor, size 2510, 4.7uH, 0.94A; Manufacturer: Wurth Elektronik; DC Resistance typ.: 338mOhm; DC Resistance max.: 388mOhm; Self Resonant Frequency: 35MHz; Saturation Current: 1.75A; ComponentLink1Description: Manufacturer; ComponentLink1URL: http://www.we-online.de; ComponentLink2Description: Datasheet; ComponentLink2URL: https://www.we-online.com/catalog/datasheet/74438323047.pdf; Mounting Technology: SMT; Operating Temperature: -40 to +125degC; Packaging: Tape and Reel; Published Date: April 2020; Size: 2510; Inductance: 4.7uH; Manufacturer Part Number: 74438323047; Rated Current: 0.94A
R16 R17 = Res_0402_3.01k: Vishay, thin film resistor 3.01k/25V/0.1%
R18 R22 = Res_0402_25k: Vishay, thin film resistor 25k/25V/0.1%
R19 = Res_0402_20k: Vishay, thin film resistor 20k/25V/0.1%
R20 R23 = Res_0402_100: Vishay, thin film resistor 100/25V/0.1%
R21 = Res_0402_487k: Vishay, thin film resistor 487k/25V/0.1%
R24 R25 = Res_0402_10k: Vishay, thin film resistor 10k/25V/0.1%

## Sheet MCU.SchDoc
size A3; Organization: Altium Limited; Address1: L3, 12a Rodborough Rd; Address2: Frenchs Forest; Address3: NSW; Address4: Australia 2086
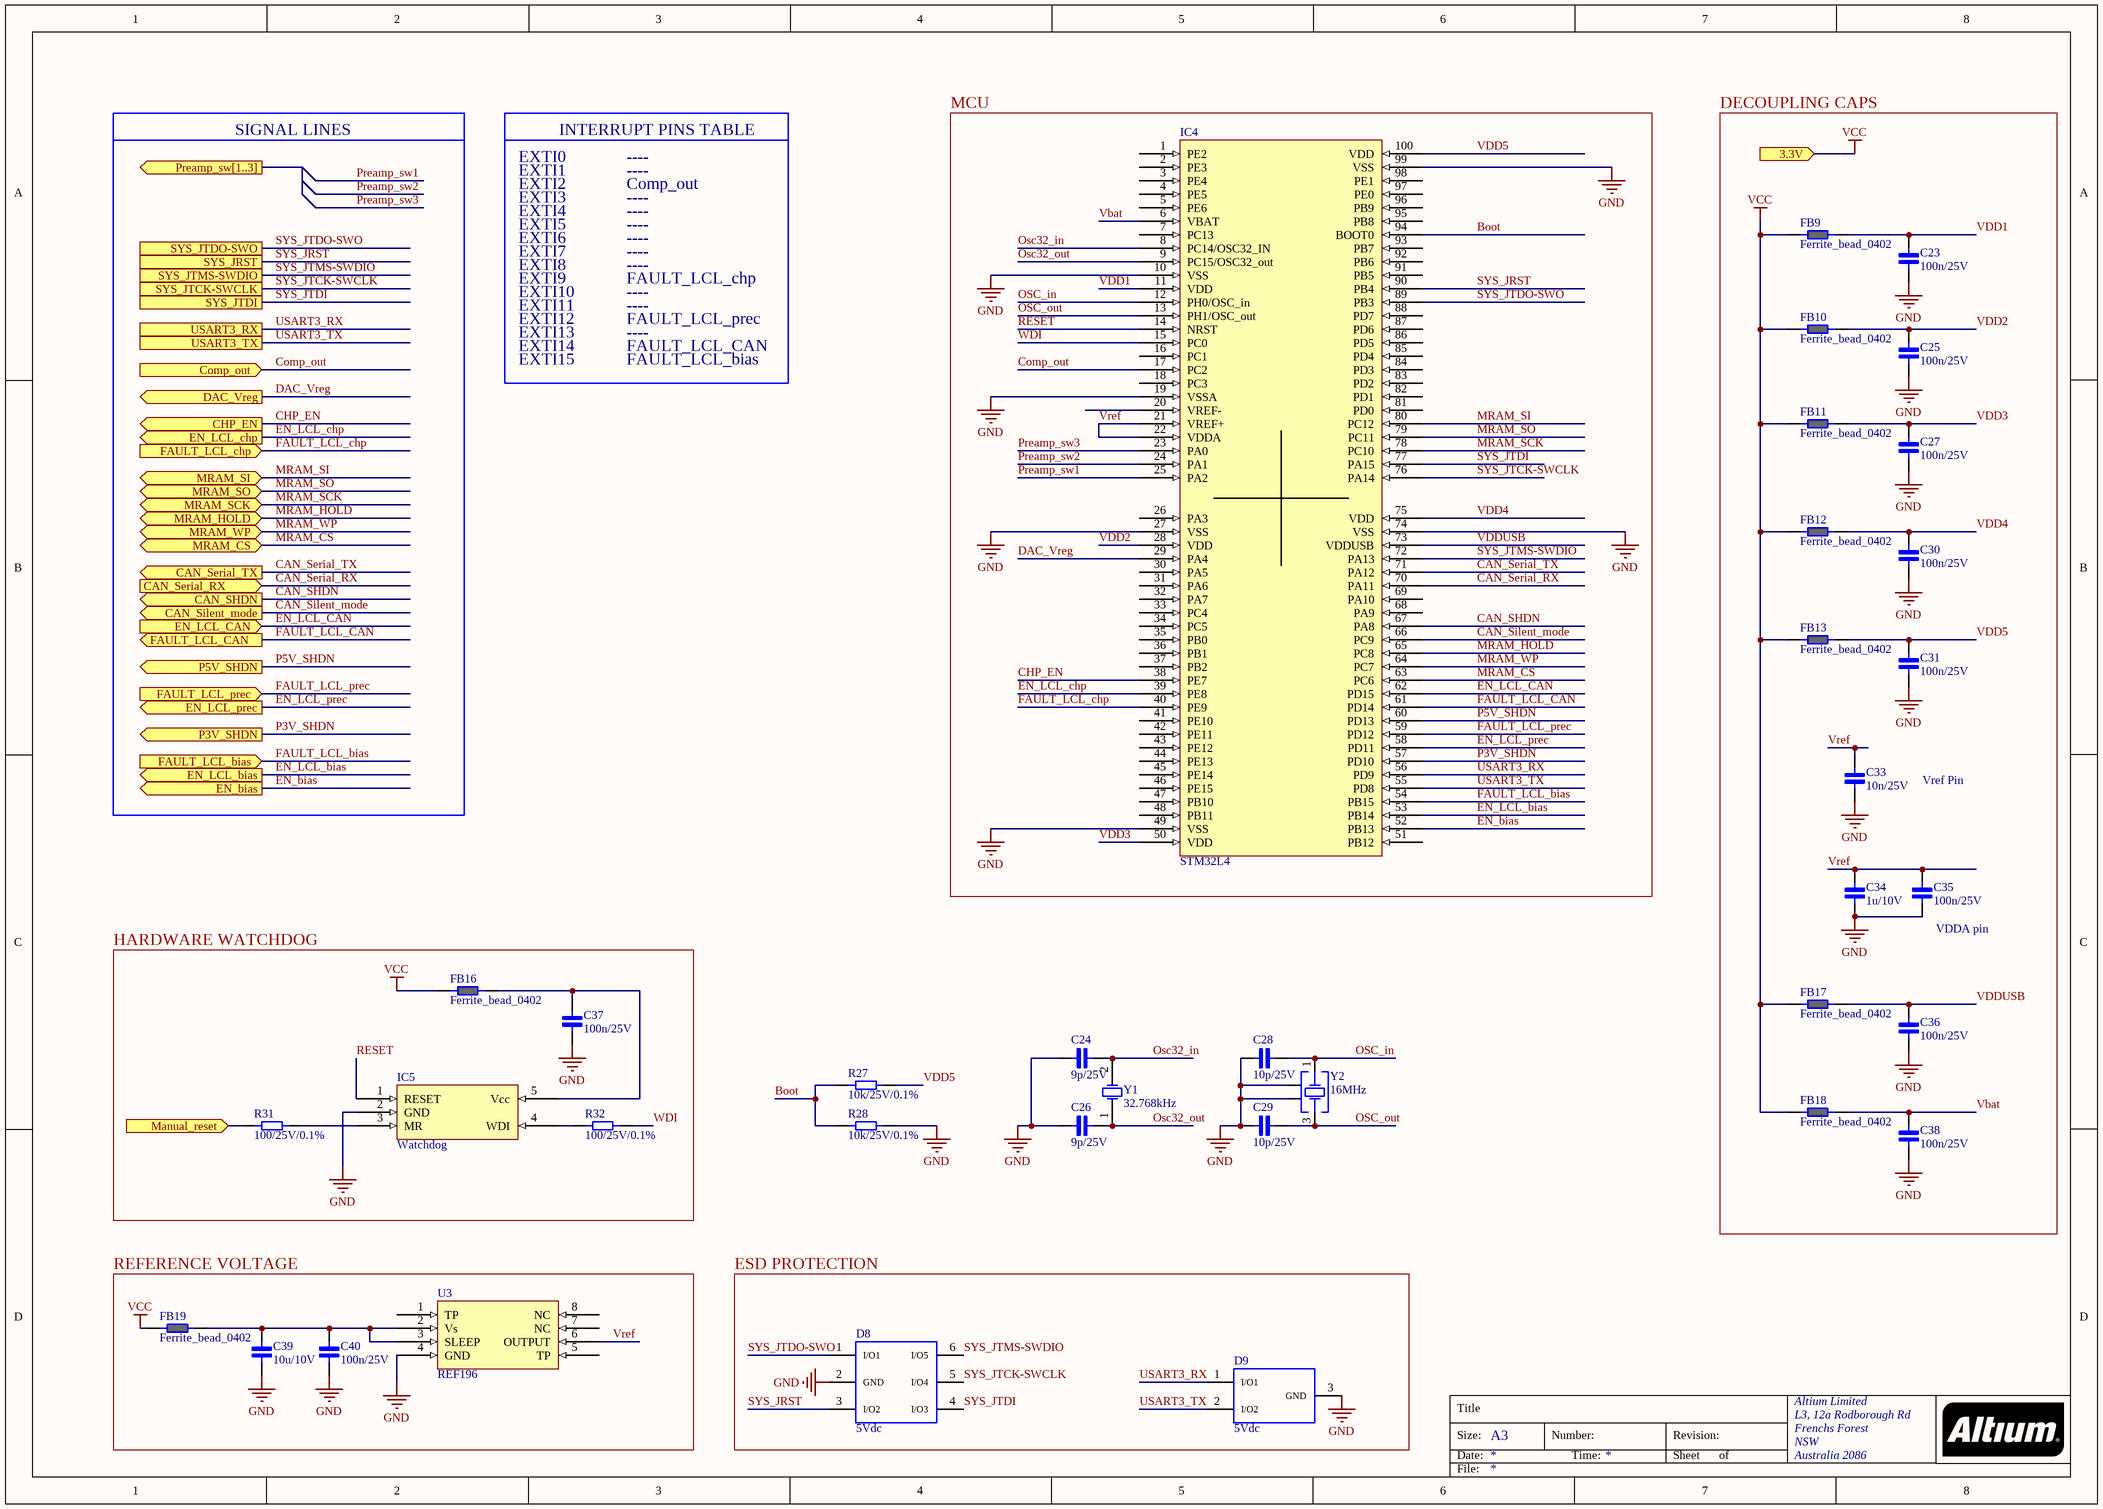
[diagram p4: MCU.SchDoc]

### Parts
C23  100n/25V  [Cap_0402]
C24  9p/25V  [Cap_0402]
C25  100n/25V  [Cap_0402]
C26  9p/25V  [Cap_0402]
C27  100n/25V  [Cap_0402]
C28  10p/25V  [Cap_0402]
C29  10p/25V  [Cap_0402]
C30  100n/25V  [Cap_0402]
C31  100n/25V  [Cap_0402]
C33  10n/25V  [Cap_0402]
C34  1u/10V  [Cap_0402]
C35  100n/25V  [Cap_0402]
C36  100n/25V  [Cap_0402]
C37  100n/25V  [Cap_0402]
C38  100n/25V  [Cap_0402]
C39  10u/10V  [CAP_0603]
C40  100n/25V  [Cap_0402]
D8  5Vdc  [WE-TVS_SOT23-6L]
D9  5Vdc  [WE-TVS_SOT23-3L]
FB9  Ferrite_bead_0402  [FERRITE_0402]
FB10  Ferrite_bead_0402  [FERRITE_0402]
FB11  Ferrite_bead_0402  [FERRITE_0402]
FB12  Ferrite_bead_0402  [FERRITE_0402]
FB13  Ferrite_bead_0402  [FERRITE_0402]
FB16  Ferrite_bead_0402  [FERRITE_0402]
FB17  Ferrite_bead_0402  [FERRITE_0402]
FB18  Ferrite_bead_0402  [FERRITE_0402]
FB19  Ferrite_bead_0402  [FERRITE_0402]
IC4  STM32L4  [LQFP100]
IC5  Watchdog  [SOT-23-5]
R27  10k/25V/0.1%  [RES_0402]
R28  10k/25V/0.1%  [RES_0402]
R31  100/25V/0.1%  [RES_0402]
R32  100/25V/0.1%  [RES_0402]
U3  REF196  [SOIC8]
Y1  32.768kHz  [WE-XTAL_IQXC-25]
Y2  16MHz  [WE-XTAL_CFPX-218]

### Blocks framed on the sheet
MCU: IC4
DECOUPLING CAPS: C23 C25 C27 C30 C31 C33-C36 C38 FB9-FB13 FB17 FB18
HARDWARE WATCHDOG: C37 FB16 IC5 R31 R32
REFERENCE VOLTAGE: C39 C40 FB19 U3
ESD PROTECTION: D8 D9

### Ports
3.3V (in), CAN_Serial_RX (in), CAN_Serial_TX (out), CAN_SHDN (out), CAN_Silent_mode (out), CHP_EN (out), Comp_out (in), DAC_Vreg (out), EN_bias (out), EN_LCL_bias (out), EN_LCL_CAN (in), EN_LCL_chp (out), EN_LCL_prec (out), FAULT_LCL_bias (in), FAULT_LCL_CAN (out), FAULT_LCL_chp (in), FAULT_LCL_prec (in), Manual_reset (in), MRAM_CS (bidir), MRAM_HOLD (bidir), MRAM_SCK (bidir), MRAM_SI (bidir), MRAM_SO (bidir), MRAM_WP (bidir), P3V_SHDN (out), P5V_SHDN (out), Preamp_sw[1..3] (out), SYS_JRST, SYS_JTCK-SWCLK, SYS_JTDI, SYS_JTDO-SWO, SYS_JTMS-SWDIO, USART3_RX, USART3_TX

### Nets
GND: C23.1 C24.1 C25.1 C26.1 C27.1 C28.1 C29.1 C30.1 C31.1 C33.1 C34.1 C35.1 C36.1 C37.1 C38.1 C39.1 C40.1 D8.2(GND) D9.3(GND) IC4.10(VSS) IC4.19(VSSA) IC4.27(VSS) IC4.49(VSS) IC4.74(VSS) IC4.99(VSS) IC5.2(GND) R28.2 U3.4(GND) Y2.2(GND) Y2.4(GND)
VCC: FB9.1 FB10.1 FB11.1 FB12.1 FB13.1 FB16.1 FB17.1 FB18.1 FB19.1 ; port 3.3V  [project net 3.3V]
Boot: IC4.94(BOOT0) R27.1 R28.1
CAN_Serial_RX: IC4.70(PA11) ; port CAN_Serial_RX
CAN_Serial_TX: IC4.71(PA12) ; port CAN_Serial_TX
CAN_SHDN: IC4.67(PA8) ; port CAN_SHDN
CAN_Silent_mode: IC4.66(PC9) ; port CAN_Silent_mode
CHP_EN: IC4.38(PE7) ; port CHP_EN
Comp_out: IC4.17(PC2) ; port Comp_out
DAC_Vreg: IC4.29(PA4) ; port DAC_Vreg
EN_bias: IC4.52(PB13) ; port EN_bias
EN_LCL_bias: IC4.53(PB14) ; port EN_LCL_bias
EN_LCL_CAN: IC4.62(PD15) ; port EN_LCL_CAN
EN_LCL_chp: IC4.39(PE8) ; port EN_LCL_chp
EN_LCL_prec: IC4.58(PD11) ; port EN_LCL_prec
FAULT_LCL_bias: IC4.54(PB15) ; port FAULT_LCL_bias
FAULT_LCL_CAN: IC4.61(PD14) ; port FAULT_LCL_CAN
FAULT_LCL_chp: IC4.40(PE9) ; port FAULT_LCL_chp
FAULT_LCL_prec: IC4.59(PD12) ; port FAULT_LCL_prec
Manual_reset: R31.1 ; port Manual_reset
MRAM_CS: IC4.63(PC6) ; port MRAM_CS
MRAM_HOLD: IC4.65(PC8) ; port MRAM_HOLD
MRAM_SCK: IC4.78(PC10) ; port MRAM_SCK
MRAM_SI: IC4.80(PC12) ; port MRAM_SI
MRAM_SO: IC4.79(PC11) ; port MRAM_SO
MRAM_WP: IC4.64(PC7) ; port MRAM_WP
Osc32_in: C24.2 IC4.8(PC14/OSC32_IN) Y1.2(OSC2)
Osc32_out: C26.2 IC4.9(PC15/OSC32_out) Y1.1(OSC1)
OSC_in: C28.2 IC4.12(PH0/OSC_in) Y2.1(Crystal)
OSC_out: C29.2 IC4.13(PH1/OSC_out) Y2.3(Crystal)
p3V_SHDN: IC4.57(PD10) ; port P3V_SHDN
P5V_SHDN: IC4.60(PD13) ; port P5V_SHDN
Preamp_sw1: IC4.25(PA2)
Preamp_sw2: IC4.24(PA1)
Preamp_sw3: IC4.23(PA0)
RESET: IC4.14(NRST) IC5.1(RESET)
SYS_JRST: D8.3(I/O2) IC4.90(PB4) ; port SYS_JRST
SYS_JTCK-SWCLK: D8.5(I/O4) IC4.76(PA14) ; port SYS_JTCK-SWCLK
SYS_JTDI: D8.4(I/O3) IC4.77(PA15) ; port SYS_JTDI
SYS_JTDO-SWO: D8.1(I/O1) IC4.89(PB3) ; port SYS_JTDO-SWO
SYS_JTMS-SWDIO: D8.6(I/O5) IC4.72(PA13) ; port SYS_JTMS-SWDIO
USART3_RX: D9.1(I/O1) IC4.56(PD9) ; port USART3_RX
USART3_TX: D9.2(I/O2) IC4.55(PD8) ; port USART3_TX
Vbat: C38.2 FB18.2 IC4.6(VBAT)
VDD1: C23.2 FB9.2 IC4.11(VDD)
VDD2: C25.2 FB10.2 IC4.28(VDD)
VDD3: C27.2 FB11.2 IC4.50(VDD)
VDD4: C30.2 FB12.2 IC4.75(VDD)
VDD5: C31.2 FB13.2 IC4.100(VDD) R27.2
VDDUSB: C36.2 FB17.2 IC4.73(VDDUSB)
Vref: C33.2 C34.2 C35.2 IC4.21(VREF+) IC4.22(VDDA) U3.6(OUTPUT)
WDI: IC4.15(PC0) R32.2
NetC37_2: C37.2 FB16.2 IC5.5(Vcc)
NetC39_2: C39.2 C40.2 FB19.2 U3.2(Vs) U3.3(SLEEP)
NetIC5_3: IC5.3(MR) R31.2
NetIC5_4: IC5.4(WDI) R32.1

Not connected (* = marked no-connect by the designer): IC4 1(PE2) 2(PE3) 3(PE4) 4(PE5) 5(PE6) 7(PC13) 16(PC1) 18(PC3) 20(VREF-) 26(PA3) 30(PA5) 31(PA6) 32(PA7) 33(PC4) 34(PC5) 35(PB0) 36(PB1) 37(PB2) 41(PE10) 42(PE11) 43(PE12) 44(PE13) 45(PE14) 46(PE15) 47(PB10) 48(PB11) 51(PB12) 68(PA9) 69(PA10) 81(PD0) 82(PD1) 83(PD2) 84(PD3) 85(PD4) 86(PD5) 87(PD6) 88(PD7) 91(PB5) 92(PB6) 93(PB7) 95(PB8) 96(PB9) 97(PE0) 98(PE1); U3 1(TP) 5(TP) 7(NC) 8(NC)

### Notes on the sheet
- SIGNAL LINES
- EXTI0
- EXTI1
- INTERRUPT PINS TABLE
- ----
- EXTI2
- EXTI3
- EXTI4
- EXTI5
- EXTI6
- Comp_out
- EXTI7
- EXTI8
- EXTI9
- EXTI10
- EXTI11
- FAULT_LCL_chp
- EXTI12
- EXTI13
- EXTI14
- EXTI15
- FAULT_LCL_prec
- FAULT_LCL_CAN
- FAULT_LCL_bias
- Vref Pin
- (near C35) VDDA pin
- Title
- Size:
- Date:
- A3
- Number:
- Time:
- Revision:
- Sheet
- of
- File:

### Library data of the parts
C23 C25 C27 C30 C31 C35-C38 C40 = Cap_0402_100n: as C3 on sheet Preamplifier; ComponentLink1Description: New link; ComponentLink1URL: https://www.we-online.com/catalog/en/WCAP-CSGP-25VDC
C24 C26 = Cap_0402_9p: 0402 / 25V / ±5%, Wurth Elektronik MLCC; ComponentLink1Description: New link; ComponentLink1URL: https://www.we-online.com/catalog/en/WCAP-CSGP-25VDC
C28 C29 = Cap_0402_10p: 0402 / 25V / ±5%, Wurth Elektronik MLCC; ComponentLink1Description: New link; ComponentLink1URL: https://www.we-online.com/catalog/en/WCAP-CSGP-25VDC
C33 = Cap_0402_10n: as C32 on sheet General_design; ComponentLink1Description: New link; ComponentLink1URL: https://www.we-online.com/catalog/en/WCAP-CSGP-25VDC
C34 = Cap_0402_1u: as C20 on sheet PIN_bias_voltage
C39 = Cap_0603_10u: Ceramic Capacitor 10uF / 0603 / 10V / ±5%, Wurth Elektronik MLCC
D8 = 82402305: WE-TVS TVS Diode - Standard Series, SOT23-6L, 5Channel, 5Vdc; Manufacturer: Wurth Elektronik; Reverse Breakdown Voltage min.: 6V; Channel: 5; Channel Input Capacitance: 13pF; Reverse Peak Pulse Current: 6A; Reverse Channel Leakage Current: 2.5uA; DC Operating Voltage: 5V; ComponentLink1Description: Manufacturer; ComponentLink1URL: http://www.we-online.de; ComponentLink2Description: Datasheet; ComponentLink2URL: https://www.we-online.com/catalog/datasheet/82402305.pdf; Manufacturer Part Number: 82402305; Published Date: April 2020; Size: SOT23-6L; Operating Temperature: -55 to +85degC; Mounting Technology: SMT; Packaging: Tape and Reel
D9 = 824021: WE-TVS TVS Diode - Standard Series, SOT23-3L, 2Channel, 5Vdc; Manufacturer: Wurth Elektronik; Reverse Breakdown Voltage min.: 6.1V; Channel: 2; Channel Input Capacitance: 55pF; Reverse Peak Pulse Current: 15A; Reverse Channel Leakage Current: 2.5uA; DC Operating Voltage: 5V; ComponentLink1Description: Manufacturer; ComponentLink1URL: http://www.we-online.de; ComponentLink2Description: Datasheet; ComponentLink2URL: https://www.we-online.com/catalog/datasheet/824021.pdf; Manufacturer Part Number: 824021; Published Date: April 2020; Size: SOT23-3L; Operating Temperature: -55 to +125degC; Mounting Technology: SMT; Packaging: Tape and Reel
FB9-FB13 FB16-FB19 = Ferrite_bead_0402: Ferrite bead, wurth 74269241102
IC4 = STM32L476VGT6: Microcontroller STM32; ComponentLink1Description: New link; ComponentLink1URL: https://www.digchip.com/datasheets/parts/datasheet/456/STM32L476-pdf.php
IC5 = MAX823: Watchdog, 5-Pin Microprocessor Supervisory Circuits With / Watchdog Timer and Manual Reset; ComponentLink1Description: New link; ComponentLink1URL: https://pl.mouser.com/datasheet/2/256/MAX823-MAX825Z-1116133.pdf
R27 R28 = Res_0402_10k: Vishay, thin film resistor 10k/25V/0.1%
R31 R32 = Res_0402_100: Vishay, thin film resistor 100/25V/0.1%
U3 = REF196: Precision Micropower, / Low Dropout Voltage References; ComponentLink1Description: New link; ComponentLink1URL: https://www.analog.com/media/en/technical-documentation/data-sheets/REF19xSeries.pdf
Y1 = 830062558: WE-XTAL Watch Crystal, SMT, IQXC-25, 32.768kHz, +/-10ppm; Manufacturer: Wurth Elektronik; Load Capacitance: 9pF; ComponentLink1Description: Manufacturer; ComponentLink1URL: http://www.we-online.de; ComponentLink2Description: Datasheet; ComponentLink2URL: https://katalog.we-online.com/pbs/datasheet/830062558.pdf; Operating Temperature: -40 to +85degC; Packaging: Tape and Reel; Manufacturer Part Number: 830062558; Published Date: July 2020; Size: IQXC-25; Frequency Stability: -; Frequency: 32.768kHz; Frequency Tolerance: +/-10ppm; Mounting Technology: SMT
Y2 = 830069392: WE-XTAL Quartz Crystal, SMT, CFPX-218, 16MHz, +/-20ppm; Manufacturer: Wurth Elektronik; Load Capacitance: 10pF; ComponentLink1Description: Manufacturer; ComponentLink1URL: http://www.we-online.de; ComponentLink2Description: Datasheet; ComponentLink2URL: https://katalog.we-online.com/pbs/datasheet/830069392.pdf; Operating Temperature: -40 to +85degC; Packaging: Tape and Reel; Manufacturer Part Number: 830069392; Published Date: July 2020; Size: CFPX-218; Frequency Stability: +/-20ppm; Frequency: 16MHz; Frequency Tolerance: +/-20ppm; Mounting Technology: SMT

## Sheet Customer_Module-Main_Sheet.SchDoc
size A4
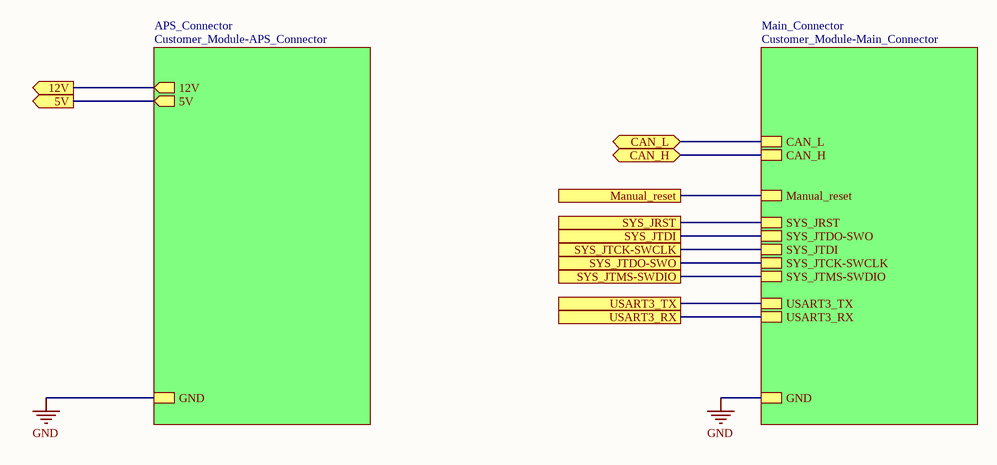
[diagram p5: Customer_Module-Main_Sheet.SchDoc]

### Sub-sheets
APS_Connector = Customer_Module-APS_Connector: GND, 12V (out), 5V (out)
Main_Connector = Customer_Module-Main_Connector: GND, CAN_L, CAN_H, SYS_JRST, SYS_JTDO-SWO, SYS_JTDI, SYS_JTCK-SWCLK, SYS_JTMS-SWDIO, USART3_TX, USART3_RX, Manual_reset

### Ports
5V (out), 12V (out), CAN_H (bidir), CAN_L (bidir), Manual_reset, SYS_JRST, SYS_JTCK-SWCLK, SYS_JTDI, SYS_JTDO-SWO, SYS_JTMS-SWDIO, USART3_RX, USART3_TX

### Nets
5V: port 5V, sheet APS_Connector/5V
12V: port 12V, sheet APS_Connector/12V
GND: sheet Main_Connector/GND, sheet APS_Connector/GND
CAN_H: port CAN_H, sheet Main_Connector/CAN_H
CAN_L: port CAN_L, sheet Main_Connector/CAN_L
Manual_reset: port Manual_reset, sheet Main_Connector/Manual_reset
SYS_JRST: port SYS_JRST, sheet Main_Connector/SYS_JRST
SYS_JTCK-SWCLK: port SYS_JTCK-SWCLK, sheet Main_Connector/SYS_JTDI
SYS_JTDI: port SYS_JTDI, sheet Main_Connector/SYS_JTDO-SWO
SYS_JTDO-SWO: port SYS_JTDO-SWO, sheet Main_Connector/SYS_JTCK-SWCLK
SYS_JTMS-SWDIO: port SYS_JTMS-SWDIO, sheet Main_Connector/SYS_JTMS-SWDIO
USART3_RX: port USART3_RX, sheet Main_Connector/USART3_RX
USART3_TX: port USART3_TX, sheet Main_Connector/USART3_TX

## Sheet Customer_Module-Main_Connector.SchDoc
size A4
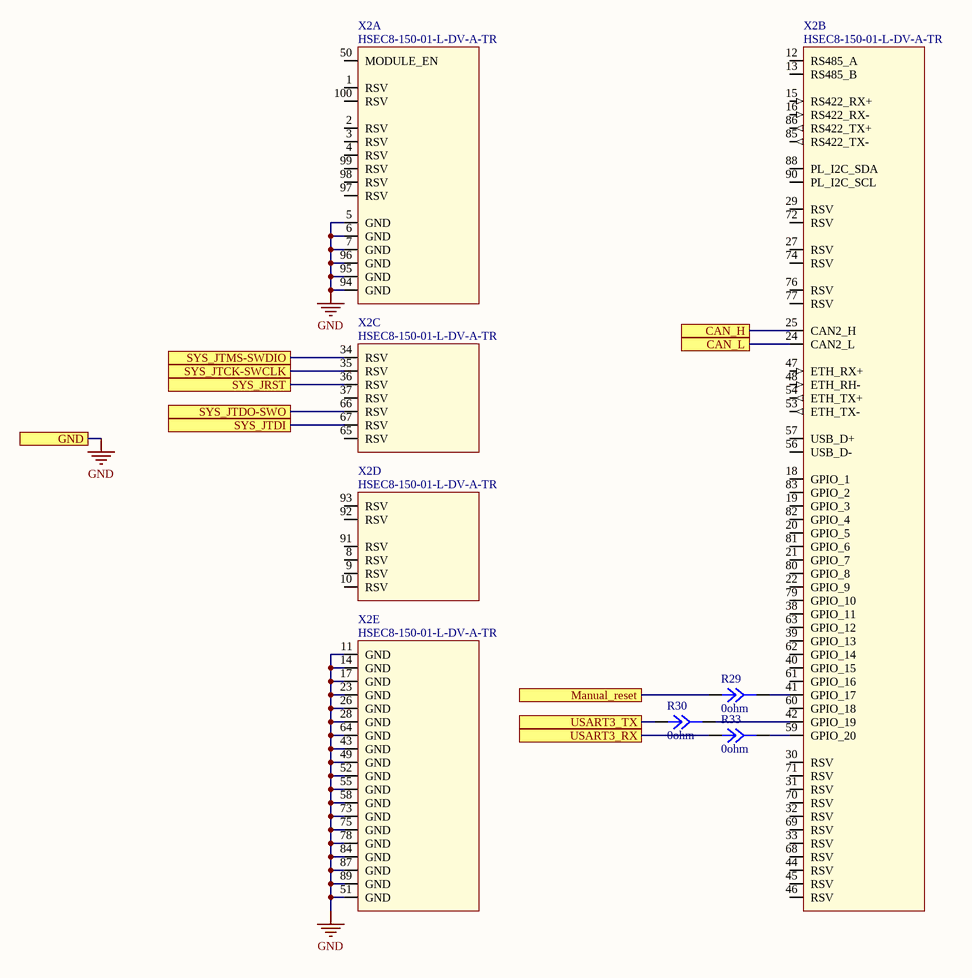
[diagram p6: Customer_Module-Main_Connector.SchDoc]

### Parts
R29  0ohm  [Jumper 2]
R30  0ohm  [Jumper 2]
R33  0ohm  [Jumper 2]
X2  HSEC8-150-01-L-DV-A-TR  [HSEC8-150-01-L-DV-A-TR]  (parts A,B,C,D,E of 5)

### Ports
CAN_H, CAN_L, GND, Manual_reset, SYS_JRST, SYS_JTCK-SWCLK, SYS_JTDI, SYS_JTDO-SWO, SYS_JTMS-SWDIO, USART3_RX, USART3_TX

### Nets
GND: X2.5(GND) X2.6(GND) X2.7(GND) X2.11(GND) X2.14(GND) X2.17(GND) X2.23(GND) X2.26(GND) X2.28(GND) X2.43(GND) X2.49(GND) X2.51(GND) X2.52(GND) X2.55(GND) X2.58(GND) X2.64(GND) X2.73(GND) X2.75(GND) X2.78(GND) X2.84(GND) X2.87(GND) X2.89(GND) X2.94(GND) X2.95(GND) X2.96(GND) ; port GND
CAN_H: X2.25(CAN2_H) ; port CAN_H
CAN_L: X2.24(CAN2_L) ; port CAN_L
Manual_reset: R29.1 ; port Manual_reset
SYS_JRST: X2.36(RSV) ; port SYS_JRST
SYS_JTCK-SWCLK: X2.67(RSV) ; port SYS_JTDI
SYS_JTDI: X2.66(RSV) ; port SYS_JTDO-SWO
SYS_JTDO-SWO: X2.35(RSV) ; port SYS_JTCK-SWCLK
SYS_JTMS-SWDIO: X2.34(RSV) ; port SYS_JTMS-SWDIO
USART3_RX: R33.1 ; port USART3_RX
USART3_TX: R30.1 ; port USART3_TX
NetR29_2: R29.2 X2.41(GPIO_17)
NetR30_2: R30.2 X2.42(GPIO_19)
NetR33_2: R33.2 X2.59(GPIO_20)

Not connected (* = marked no-connect by the designer): X2 1(RSV) 2(RSV) 3(RSV) 4(RSV) 8(RSV) 9(RSV) 10(RSV) 12(RS485_A) 13(RS485_B) 15(RS422_RX+) 16(RS422_RX-) 18(GPIO_1) 19(GPIO_3) 20(GPIO_5) 21(GPIO_7) 22(GPIO_9) 27(RSV) 29(RSV) 30(RSV) 31(RSV) 32(RSV) 33(RSV) 37(RSV) 38(GPIO_11) 39(GPIO_13) 40(GPIO_15) 44(RSV) 45(RSV) 46(RSV) 47(ETH_RX+) 48(ETH_RH-) 50(MODULE_EN) 53(ETH_TX-) 54(ETH_TX+) 56(USB_D-) 57(USB_D+) 60(GPIO_18) 61(GPIO_16) 62(GPIO_14) 63(GPIO_12) 65(RSV) 68(RSV) 69(RSV) 70(RSV) 71(RSV) 72(RSV) 74(RSV) 76(RSV) 77(RSV) 79(GPIO_10) 80(GPIO_8) 81(GPIO_6) 82(GPIO_4) 83(GPIO_2) 85(RS422_TX-) 86(RS422_TX+) 88(PL_I2C_SDA) 90(PL_I2C_SCL) 91(RSV) 92(RSV) 93(RSV) 97(RSV) 98(RSV) 99(RSV) 100(RSV)

### Library data of the parts
R29 R30 R33 = Mini jumper

## Sheet Customer_Module-APS_Connector.SchDoc
size A4
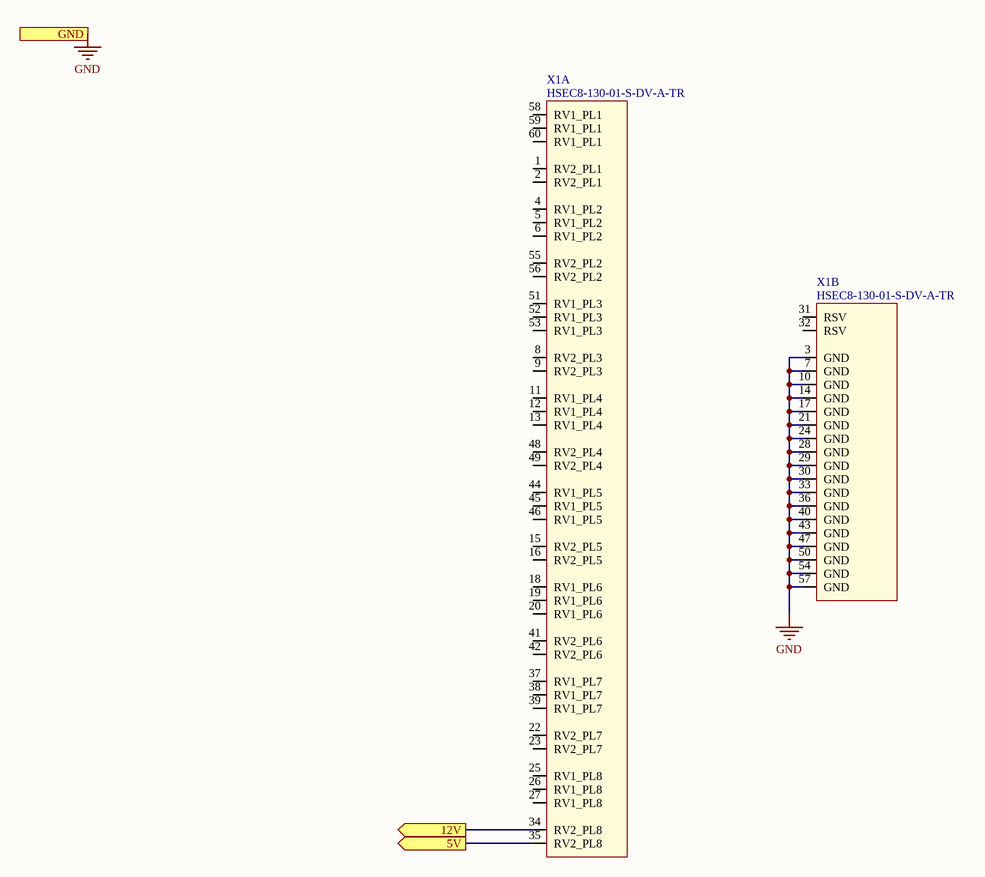
[diagram p7: Customer_Module-APS_Connector.SchDoc]

### Parts
X1  HSEC8-130-01-S-DV-A-TR  [HSEC8-130-01-S-DV-A-TR]  (parts A,B of 2)

### Ports
5V (out), 12V (out), GND

### Nets
5V: X1.35(RV2_PL8) ; port 5V
12V: X1.34(RV2_PL8) ; port 12V
GND: X1.3(GND) X1.7(GND) X1.10(GND) X1.14(GND) X1.17(GND) X1.21(GND) X1.24(GND) X1.28(GND) X1.29(GND) X1.30(GND) X1.33(GND) X1.36(GND) X1.40(GND) X1.43(GND) X1.47(GND) X1.50(GND) X1.54(GND) X1.57(GND) ; port GND

Not connected (* = marked no-connect by the designer): X1 1(RV2_PL1) 2(RV2_PL1) 4(RV1_PL2) 5(RV1_PL2) 6(RV1_PL2) 8(RV2_PL3) 9(RV2_PL3) 11(RV1_PL4) 12(RV1_PL4) 13(RV1_PL4) 15(RV2_PL5) 16(RV2_PL5) 18(RV1_PL6) 19(RV1_PL6) 20(RV1_PL6) 22(RV2_PL7) 23(RV2_PL7) 25(RV1_PL8) 26(RV1_PL8) 27(RV1_PL8) 31(RSV) 32(RSV) 37(RV1_PL7) 38(RV1_PL7) 39(RV1_PL7) 41(RV2_PL6) 42(RV2_PL6) 44(RV1_PL5) 45(RV1_PL5) 46(RV1_PL5) 48(RV2_PL4) 49(RV2_PL4) 51(RV1_PL3) 52(RV1_PL3) 53(RV1_PL3) 55(RV2_PL2) 56(RV2_PL2) 58(RV1_PL1) 59(RV1_PL1) 60(RV1_PL1)

## Sheet Comparator.SchDoc
size A3; Organization: Altium Limited; Address1: L3, 12a Rodborough Rd; Address2: Frenchs Forest; Address3: NSW; Address4: Australia 2086
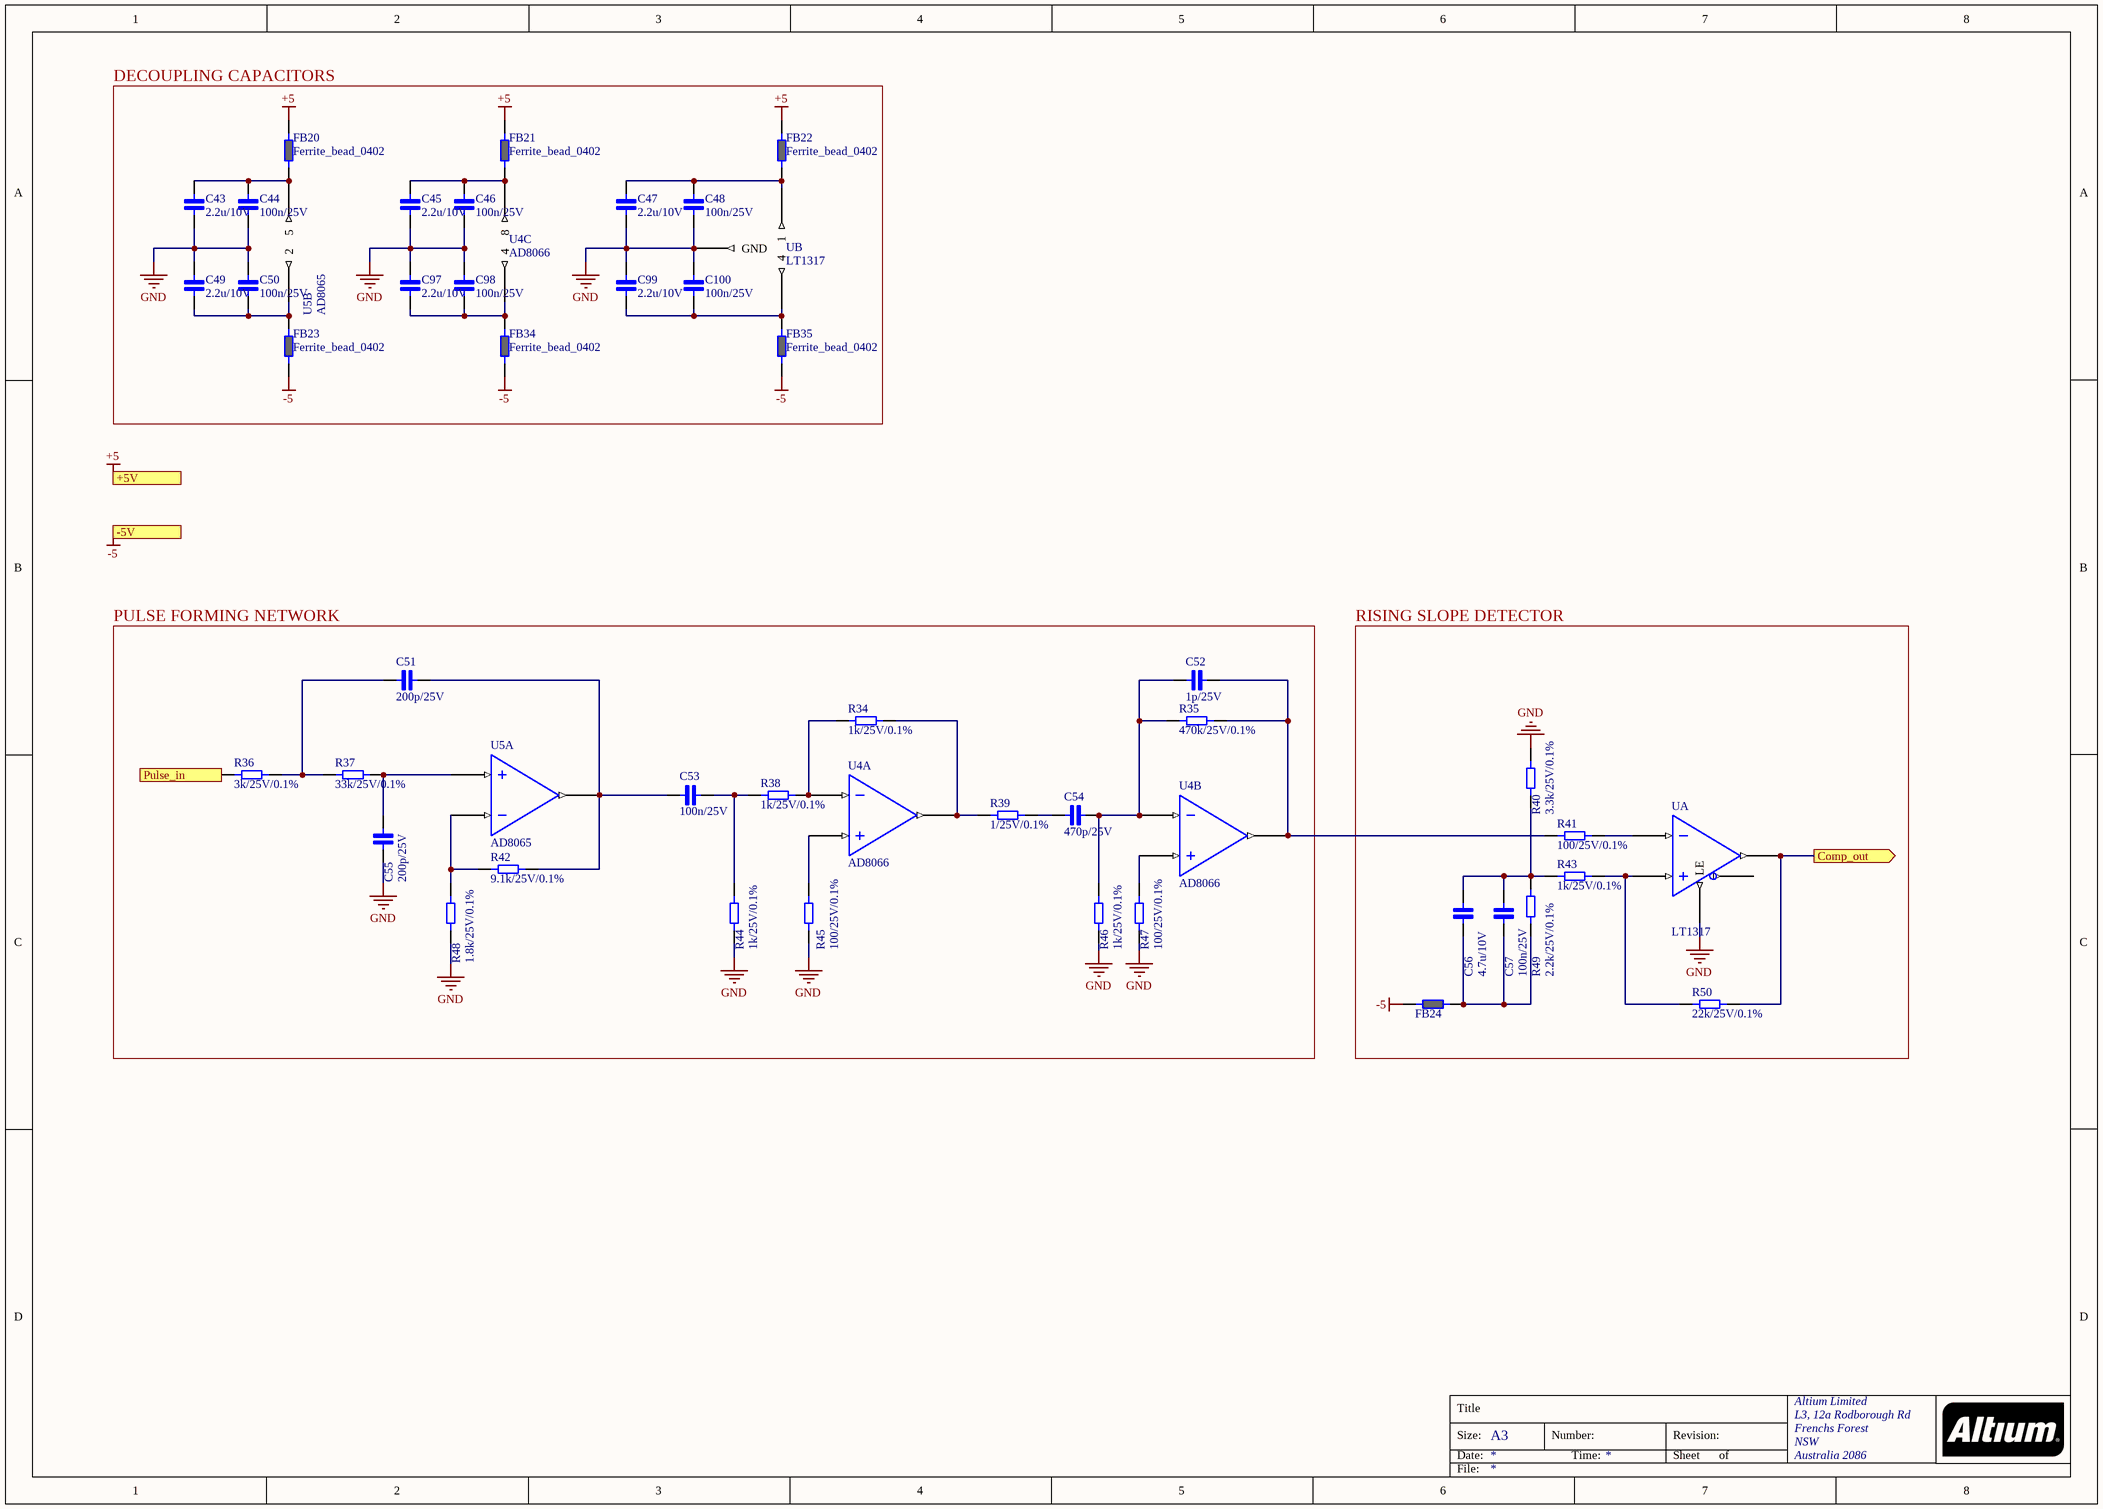
[diagram p8: Comparator.SchDoc]

### Parts
(Parts that share a designator on the sheet are numbered #1, #2 ... from top to bottom, then left to right.)
C43  2.2u/10V  [Cap_0402]
C44  100n/25V  [Cap_0402]
C45  2.2u/10V  [Cap_0402]
C46  100n/25V  [Cap_0402]
C47  2.2u/10V  [Cap_0402]
C48  100n/25V  [Cap_0402]
C49  2.2u/10V  [Cap_0402]
C50  100n/25V  [Cap_0402]
C51  200p/25V  [CAP_0603]
C52  1p/25V  [CAP_0603]
C53  100n/25V  [CAP_0603]
C54  470p/25V  [CAP_0603]
C55  200p/25V  [CAP_0603]
C56  4.7u/10V  [CAP_0603]
C57#1  100n/25V  [CAP_0603]
C97  2.2u/10V  [Cap_0402]
C98  100n/25V  [Cap_0402]
C99  2.2u/10V  [Cap_0402]
C100  100n/25V  [Cap_0402]
FB20  Ferrite_bead_0402  [FERRITE_0402]
FB21  Ferrite_bead_0402  [FERRITE_0402]
FB22  Ferrite_bead_0402  [FERRITE_0402]
FB23  Ferrite_bead_0402  [FERRITE_0402]
FB24  Ferrite_bead_0603  [Ferrite_0603]  (value not drawn)
FB34  Ferrite_bead_0402  [FERRITE_0402]
FB35  Ferrite_bead_0402  [FERRITE_0402]
R34  1k/25V/0.1%  [RES_0603]
R35  470k/25V/0.1%  [RES_0603]
R36  3k/25V/0.1%  [RES_0603]
R37  33k/25V/0.1%  [RES_0603]
R38  1k/25V/0.1%  [RES_0603]
R39  1/25V/0.1%  [CAP_0603]
R40  3.3k/25V/0.1%  [RES_0603]
R41  100/25V/0.1%  [RES_0603]
R42  9.1k/25V/0.1%  [RES_0603]
R43  1k/25V/0.1%  [RES_0603]
R44  1k/25V/0.1%  [RES_0603]
R45  100/25V/0.1%  [RES_0603]
R46  1k/25V/0.1%  [RES_0603]
R47  100/25V/0.1%  [RES_0603]
R48  1.8k/25V/0.1%  [RES_0603]
R49  2.2k/25V/0.1%  [RES_0603]
R50  22k/25V/0.1%  [RES_0603]
U  LT1317  [MSOP-8]  (parts A,B of 2)
U4  AD8066  [SOIC8]  (parts A,B,C of 3)
U5  AD8065  [SOT-23-5]  (parts A,B of 2)

### Blocks framed on the sheet
DECOUPLING CAPACITORS: C43-C50 C97-C100 FB20-FB23 FB34 FB35 U U4 U5
PULSE FORMING NETWORK: C51-C55 R34-R39 R42 R44-R48 U4 U5
RISING SLOPE DETECTOR: C56 C57#1 FB24 R40 R41 R43 R49 R50 U

### Ports
+5V (in), -5V (in), Comp_out (out), Pulse_in (in)

### Nets
+5: FB20.2 FB21.2 FB22.2 ; port +5V
-5: FB23.1 FB24.2 FB34.1 FB35.1 ; port -5V
GND: C43.1 C44.1 C45.1 C46.1 C47.1 C48.1 C49.2 C50.2 C55.1 C97.2 C98.2 C99.2 C100.2 R40.2 R44.1 R45.1 R46.1 R47.1 R48.2 U.5(LE) U.6(GND)
Comp_out: R50.2 U.7 ; port Comp_out
Pulse_in: R36.2 ; port Pulse_in
NetC43_2: C43.2 C44.2 FB20.1 U5.5
NetC45_2: C45.2 C46.2 FB21.1 U4.8
NetC47_2: C47.2 C48.2 FB22.1 U.1
NetC49_1: C49.1 C50.1 FB23.2 U5.2
NetC51_1: C51.1 R36.2 R37.2
NetC51_2: C51.2 C53.1 R42.2 U5.1
NetC52_1: C52.1 C54.2 R35.2 R46.2 U4.6
NetC52_2: C52.2 R35.2 R41.1 U4.7
NetC53_2: C53.2 R38.1 R44.2
NetC54_1: C54.1 R39.2
NetC55_2: C55.2 R37.2 U5.3
NetC56_1: C56.1 C57#1.2 FB24.1 R49.2
NetC56_2: C56.2 C57#1.1 R40.2 R43.1 R49.2
NetC97_1: C97.1 C98.1 FB34.2 U4.4
NetC99_1: C99.1 C100.1 FB35.2 U.4
NetR34_1: R34.1 R38.2 U4.2
NetR34_2: R34.2 R39.2 U4.1
NetR41_2: R41.2 U.3
NetR42_2: R42.2 R48.2 U5.4
NetR43_2: R43.2 R50.2 U.2
NetR45_2: R45.2 U4.3
NetR47_2: R47.2 U4.5

Not connected (* = marked no-connect by the designer): U 8

### Notes on the sheet
- Title
- Size:
- Date:
- A3
- Number:
- Time:
- Revision:
- Sheet
- of
- File:

### Library data of the parts
C43 C45 C47 C49 C97 C99 = Cap_0402_2.2u: as C2 on sheet Preamplifier
C44 C46 C48 C50 C98 C100 = Cap_0402_100n: as C3 on sheet Preamplifier; ComponentLink1Description: New link; ComponentLink1URL: https://www.we-online.com/catalog/en/WCAP-CSGP-25VDC
C51 C55 = Cap_0603_200p: Ceramic Capacitor 200p / 0603 / 25V / ±5%, Wurth Elektronik MLCC; ComponentLink1Description: New link; ComponentLink1URL: https://www.we-online.com/catalog/en/WCAP-CSGP-25VDC
C52 = Cap_0603_1p: Ceramic Capacitor 1p / 0603 / 25V / ±5%, Wurth Elektronik MLCC; ComponentLink1Description: New link; ComponentLink1URL: https://www.we-online.com/catalog/en/WCAP-CSGP-25VDC
C53 C57#1 = Cap_0603_100n: Ceramic Capacitor 100n / 0603 / 25V / ±5%, Wurth Elektronik MLCC; ComponentLink1Description: New link; ComponentLink1URL: https://www.we-online.com/catalog/en/WCAP-CSGP-25VDC
C54 = Cap_0603_470p: Ceramic Capacitor 470p / 0603 / 25V / ±5%, Wurth Elektronik MLCC; ComponentLink1Description: New link; ComponentLink1URL: https://www.we-online.com/catalog/en/WCAP-CSGP-25VDC
C56 = Cap_0603_4.7u: Ceramic Capacitor 4.7u / 0603 / 10V / ±5%, Wurth Elektronik MLCC
FB20-FB23 FB34 FB35 = Ferrite_bead_0402: Ferrite bead, wurth 74269241102
FB24 = Ferrite_bead_0603: Ferrite bead
R34 R38 R43 R44 R46 = Res_0603_1k: Vishay, thin film resistor 1k/25V/0.1%
R35 = Res_0603_470k: Vishay, thin film resistor 470k/25V/0.1%
R36 = Res_0603_3k: Vishay, thin film resistor 3k/25V/0.1%
R37 = Res_0603_33k: Vishay, thin film resistor 33k/25V/0.1%
R39 = Res_0603_1: Vishay, thin film resistor 1/25V/0.1%
R40 = Res_0603_3.3k: Vishay, thin film resistor 3.3k/25V/0.1%
R41 R45 R47 = Res_0603_100: Vishay, thin film resistor 100/25V/0.1%
R42 = Res_0603_9.1k: Vishay, thin film resistor 9.1k/25V/0.1%
R48 = Res_0603_1.8k: Vishay, thin film resistor 1.8k/25V/0.1%
R49 = Res_0603_2.2k: Vishay, thin film resistor 2.2k/25V/0.1%
R50 = Res_0603_22k: Vishay, thin film resistor 22k/25V/0.1%
U = LT1317: Single, 7ns, Low Power, / 3V/5V/±5V Rail-to-Rail Comparators; ComponentLink1Description: New link; ComponentLink1URL: https://pl.mouser.com/ProductDetail/Analog-Devices/LT1713CMS8PBF?qs=ytflclh7QUW98nqGG0sqzA%3D%3D
U4 = AD8066: High Performance, 145 MHz / FastFET Op Amps; ComponentLink1Description: New link; ComponentLink1URL: https://pl.mouser.com/ProductDetail/Analog-Devices/AD8066ARZ-R7?qs=%2FtpEQrCGXCwSsy1qvxfKJg%3D%3D
U5 = AD8065: High Performance, 145 MHz / FastFET Op Amps; ComponentLink1Description: New link; ComponentLink1URL: https://pl.mouser.com/datasheet/2/609/AD8065_8066-1502028.pdf

## Sheet Symmetric_PS.SchDoc
size A3; Organization: Altium Limited; Address1: L3, 12a Rodborough Rd; Address2: Frenchs Forest; Address3: NSW; Address4: Australia 2086
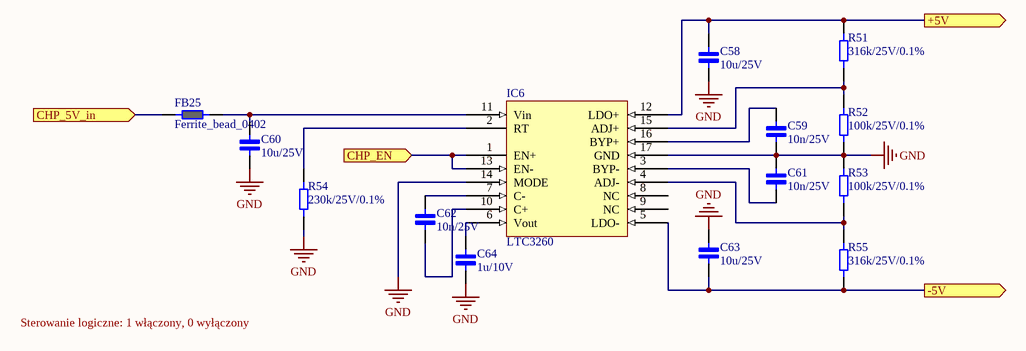
[diagram p9: Symmetric_PS.SchDoc]

### Parts
C58  10u/25V  [CAP_0805]
C59  10n/25V  [Cap_0402]
C60  10u/25V  [CAP_0805]
C61  10n/25V  [Cap_0402]
C62  10n/25V  [Cap_0402]
C63  10u/25V  [CAP_0805]
C64  1u/10V  [Cap_0402]
FB25  Ferrite_bead_0402  [FERRITE_0402]
IC6  LTC3260  [MSOP-16]
R51  316k/25V/0.1%  [RES_0402]
R52  100k/25V/0.1%  [RES_0402]
R53  100k/25V/0.1%  [RES_0402]
R54  230k/25V/0.1%  [RES_0402]
R55  316k/25V/0.1%  [RES_0402]

### Ports
+5V (out), -5V (out), CHP_5V_in (in), CHP_EN (in)

### Nets
+5: C58.2 IC6.12(LDO+) R51.2 ; port +5V
-5: C63.1 IC6.5(LDO-) R55.1 ; port -5V
GND: C58.1 C59.1 C60.1 C61.2 C63.2 C64.1 IC6.14(MODE) IC6.17(GND) R52.1 R53.2 R54.1
CHP_5V_in: FB25.1 ; port CHP_5V_in
CHP_EN: IC6.1(EN+) IC6.13(EN-) ; port CHP_EN
NetC59_2: C59.2 IC6.16(BYP+)
NetC60_2: C60.2 FB25.2 IC6.11(Vin)
NetC61_1: C61.1 IC6.3(BYP-)
NetC62_1: C62.1 IC6.10(C+)
NetC62_2: C62.2 IC6.7(C-)
NetC64_2: C64.2 IC6.6(Vout)
NetIC6_2: IC6.2(RT) R54.2
NetIC6_4: IC6.4(ADJ-) R53.1 R55.2
NetIC6_15: IC6.15(ADJ+) R51.1 R52.2

Not connected (* = marked no-connect by the designer): IC6 8(NC) 9(NC)

### Notes on the sheet
- Sterowanie logiczne: 1 włączony, 0 wyłączony
- Title
- Size:
- Date:
- A3
- Number:
- Time:
- Revision:
- Sheet
- of
- File:

### Library data of the parts
C58 C60 C63 = Cap_0805_10u_25v: Ceramic Capacitor 10uF / 0805 / 25V / ±5%, Wurth Elektronik MLCC
C59 C61 C62 = Cap_0402_10n: as C32 on sheet General_design; ComponentLink1Description: New link; ComponentLink1URL: https://www.we-online.com/catalog/en/WCAP-CSGP-25VDC
C64 = Cap_0402_1u: as C20 on sheet PIN_bias_voltage
FB25 = Ferrite_bead_0402: Ferrite bead, wurth 74269241102
IC6 = LTC3260: Charge pump, low noise; ComponentLink1Description: New link; ComponentLink1URL: https://pl.mouser.com/datasheet/2/609/3260fa-1271271.pdf
R51 R55 = Res_0402_316k: Vishay, thin film resistor 316k/25V/0.1%
R52 R53 = Res_0402_100k: Vishay, thin film resistor 100k/25V/0.1%
R54 = Res_0402_230k: Vishay, thin film resistor 230k/25V/0.1%

## Sheet prec_3V_LDO.SchDoc
size A3; Organization: Altium Limited; Address1: L3, 12a Rodborough Rd; Address2: Frenchs Forest; Address3: NSW; Address4: Australia 2086
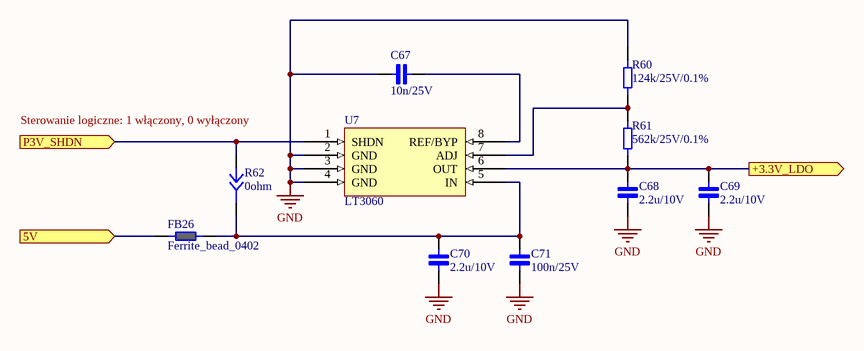
[diagram p10: prec_3V_LDO.SchDoc]

### Parts
(Parts that share a designator on the sheet are numbered #1, #2 ... from top to bottom, then left to right.)
C67  10n/25V  [Cap_0402]
C68  2.2u/10V  [Cap_0402]
C69  2.2u/10V  [Cap_0402]
C70  2.2u/10V  [Cap_0402]
C71  100n/25V  [Cap_0402]
FB26  Ferrite_bead_0402  [FERRITE_0402]
R60  124k/25V/0.1%  [RES_0402]
R61  562k/25V/0.1%  [RES_0402]
R62#1  0ohm  [Jumper 2]
U7  LT3060  [TS8]

### Ports
5V (in), +3.3V_LDO (out), P3V_SHDN (in)

### Nets
5V: FB26.1 ; port 5V
GND: C67.1 C68.1 C69.1 C70.1 C71.1 R60.2 U7.2(GND) U7.3(GND) U7.4(GND)
+3.3V_LDO: C68.2 C69.2 R61.1 U7.6(OUT) ; port +3.3V_LDO
p3V_SHDN: R62#1.2 U7.1(SHDN) ; port P3V_SHDN
NetC67_2: C67.2 U7.8(REF/BYP)
NetC70_2: C70.2 C71.2 FB26.2 R62#1.2 U7.5(IN)
NetR60_1: R60.1 R61.2 U7.7(ADJ)

### Notes on the sheet
- Sterowanie logiczne: 1 włączony, 0 wyłączony
- Title
- Size:
- Date:
- A3
- Number:
- Time:
- Revision:
- Sheet
- of
- File:

### Library data of the parts
C67 = Cap_0402_10n: as C32 on sheet General_design; ComponentLink1Description: New link; ComponentLink1URL: https://www.we-online.com/catalog/en/WCAP-CSGP-25VDC
C68-C70 = Cap_0402_2.2u: as C2 on sheet Preamplifier
C71 = Cap_0402_100n: as C3 on sheet Preamplifier; ComponentLink1Description: New link; ComponentLink1URL: https://www.we-online.com/catalog/en/WCAP-CSGP-25VDC
FB26 = Ferrite_bead_0402: Ferrite bead, wurth 74269241102
R60 = Res_0402_124k: Vishay, thin film resistor 124k/25V/0.1%
R61 = Res_0402_562k: Vishay, thin film resistor 562k/25V/0.1%
R62#1 = Jumper
U7 = Lt3060: 45V VIN, Micropower, / Low Noise, 100mA Low / Dropout, Linear Regulator